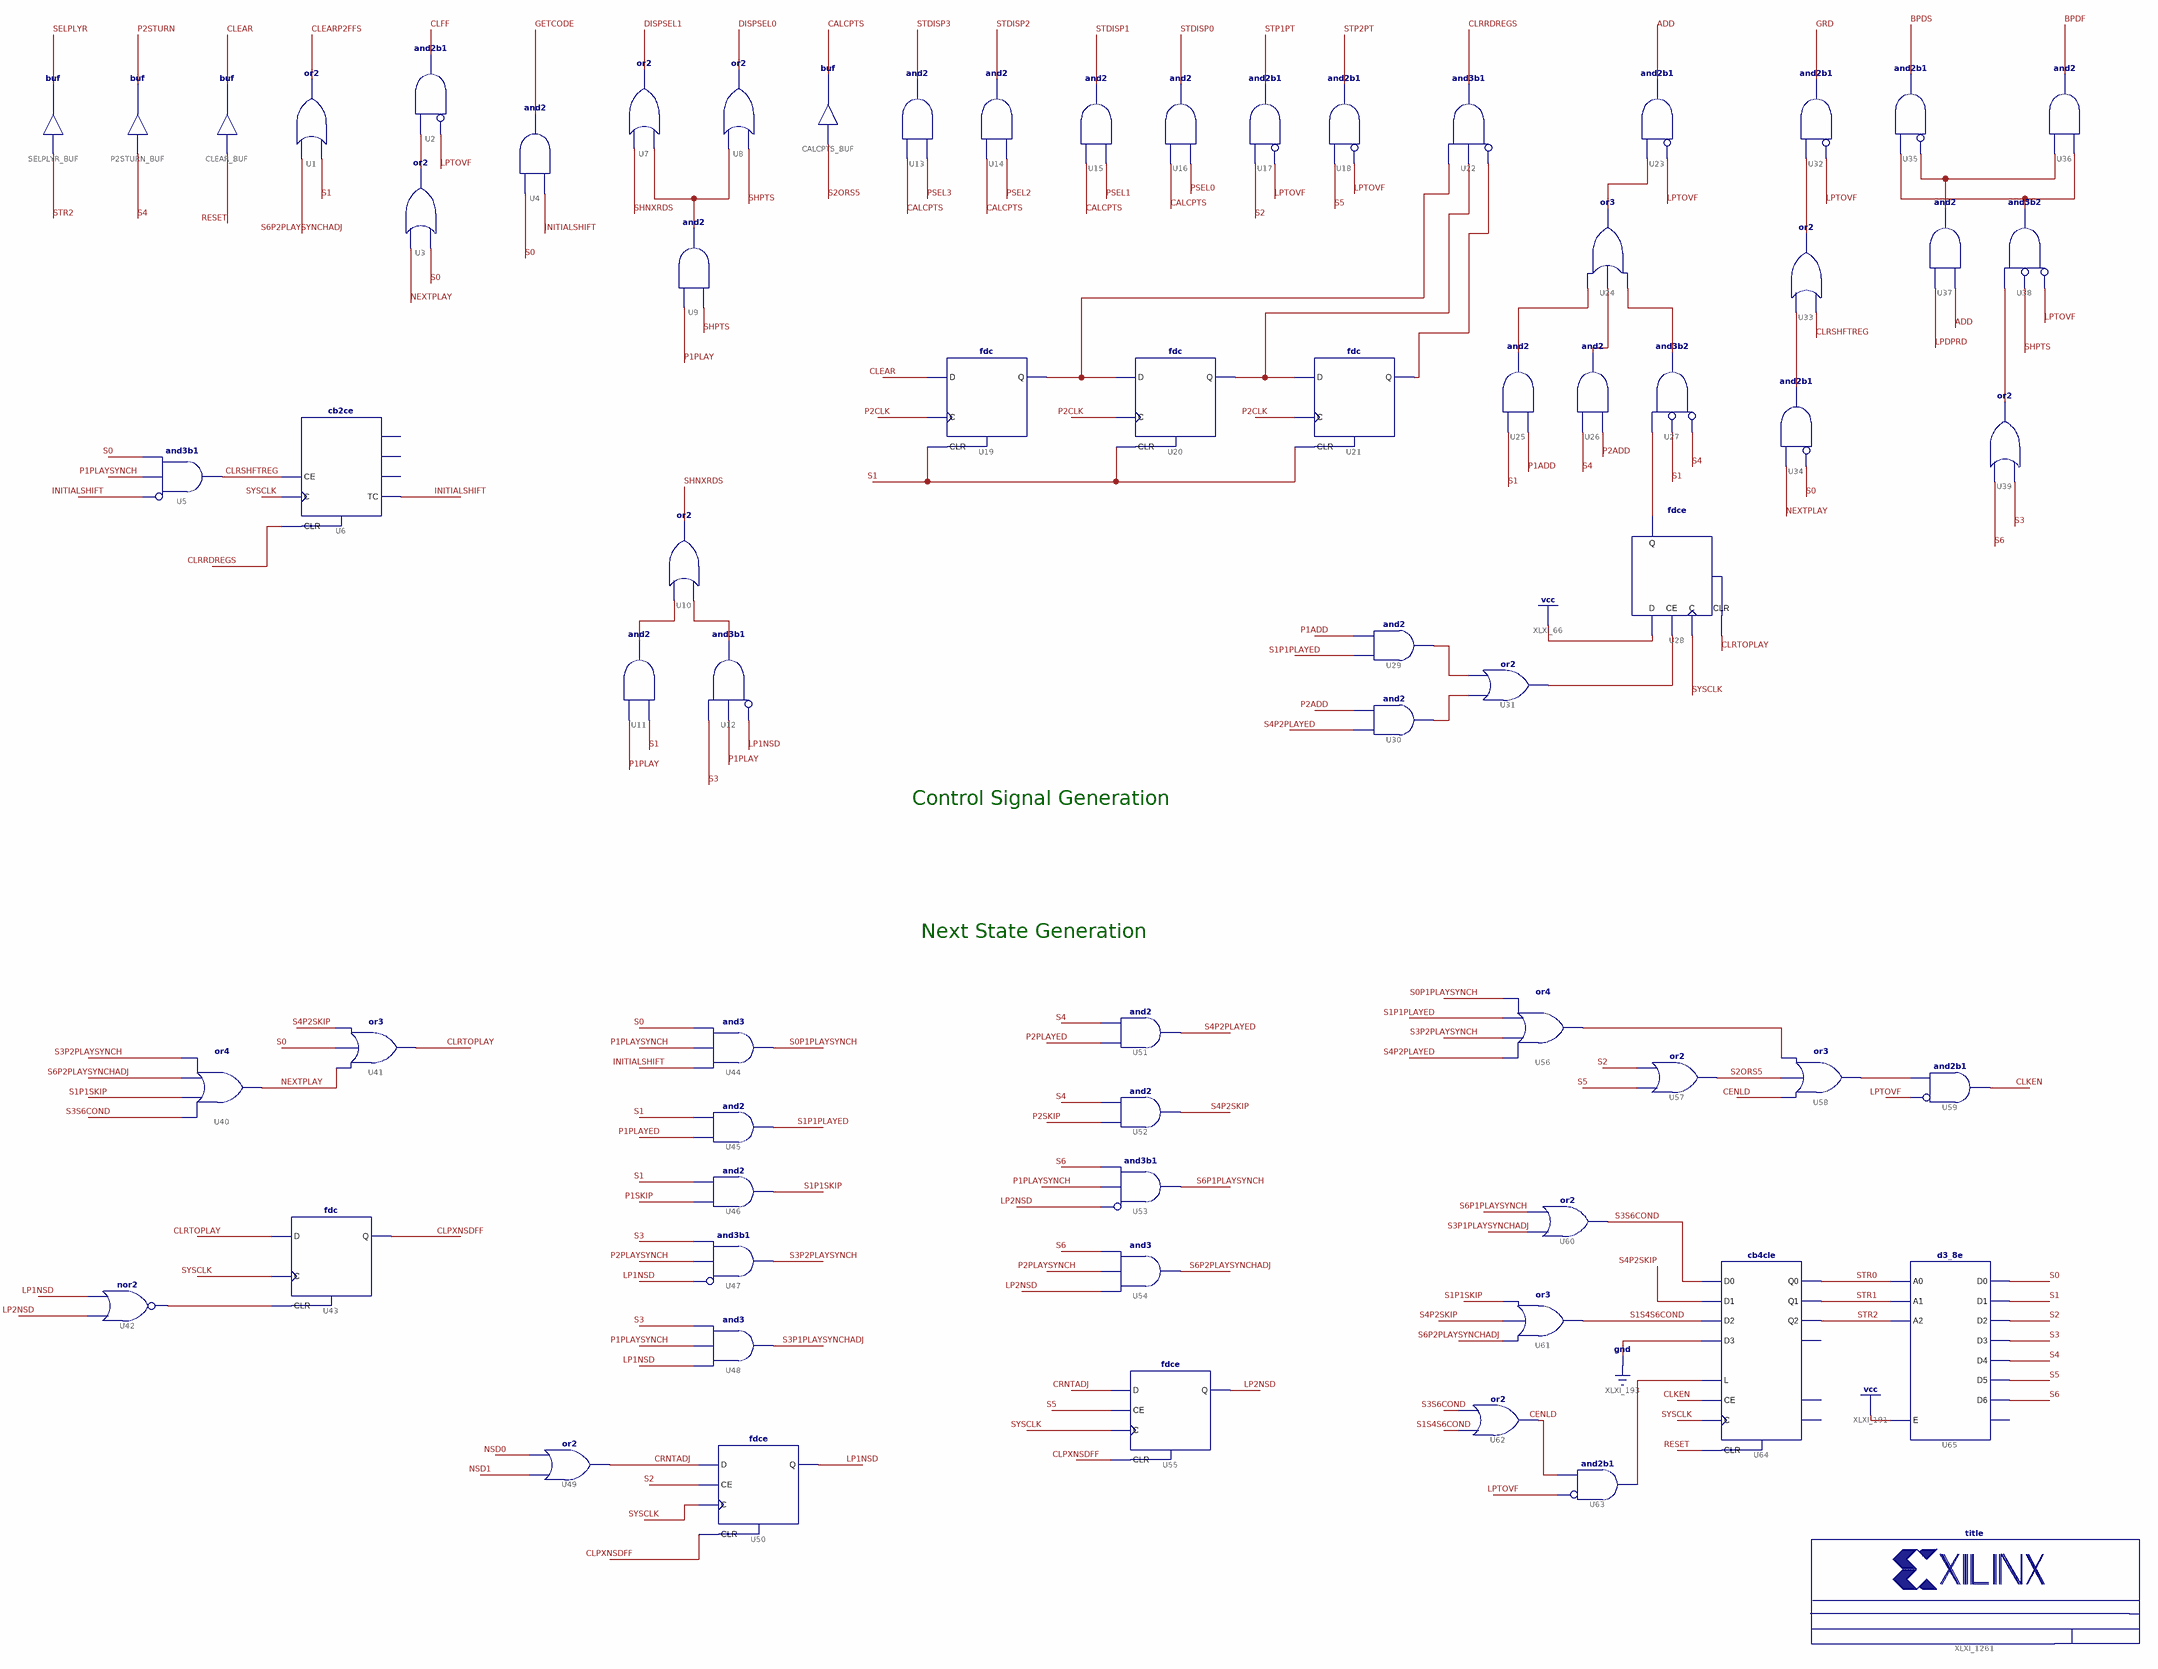
[diagram p0: schematic sheet 1]
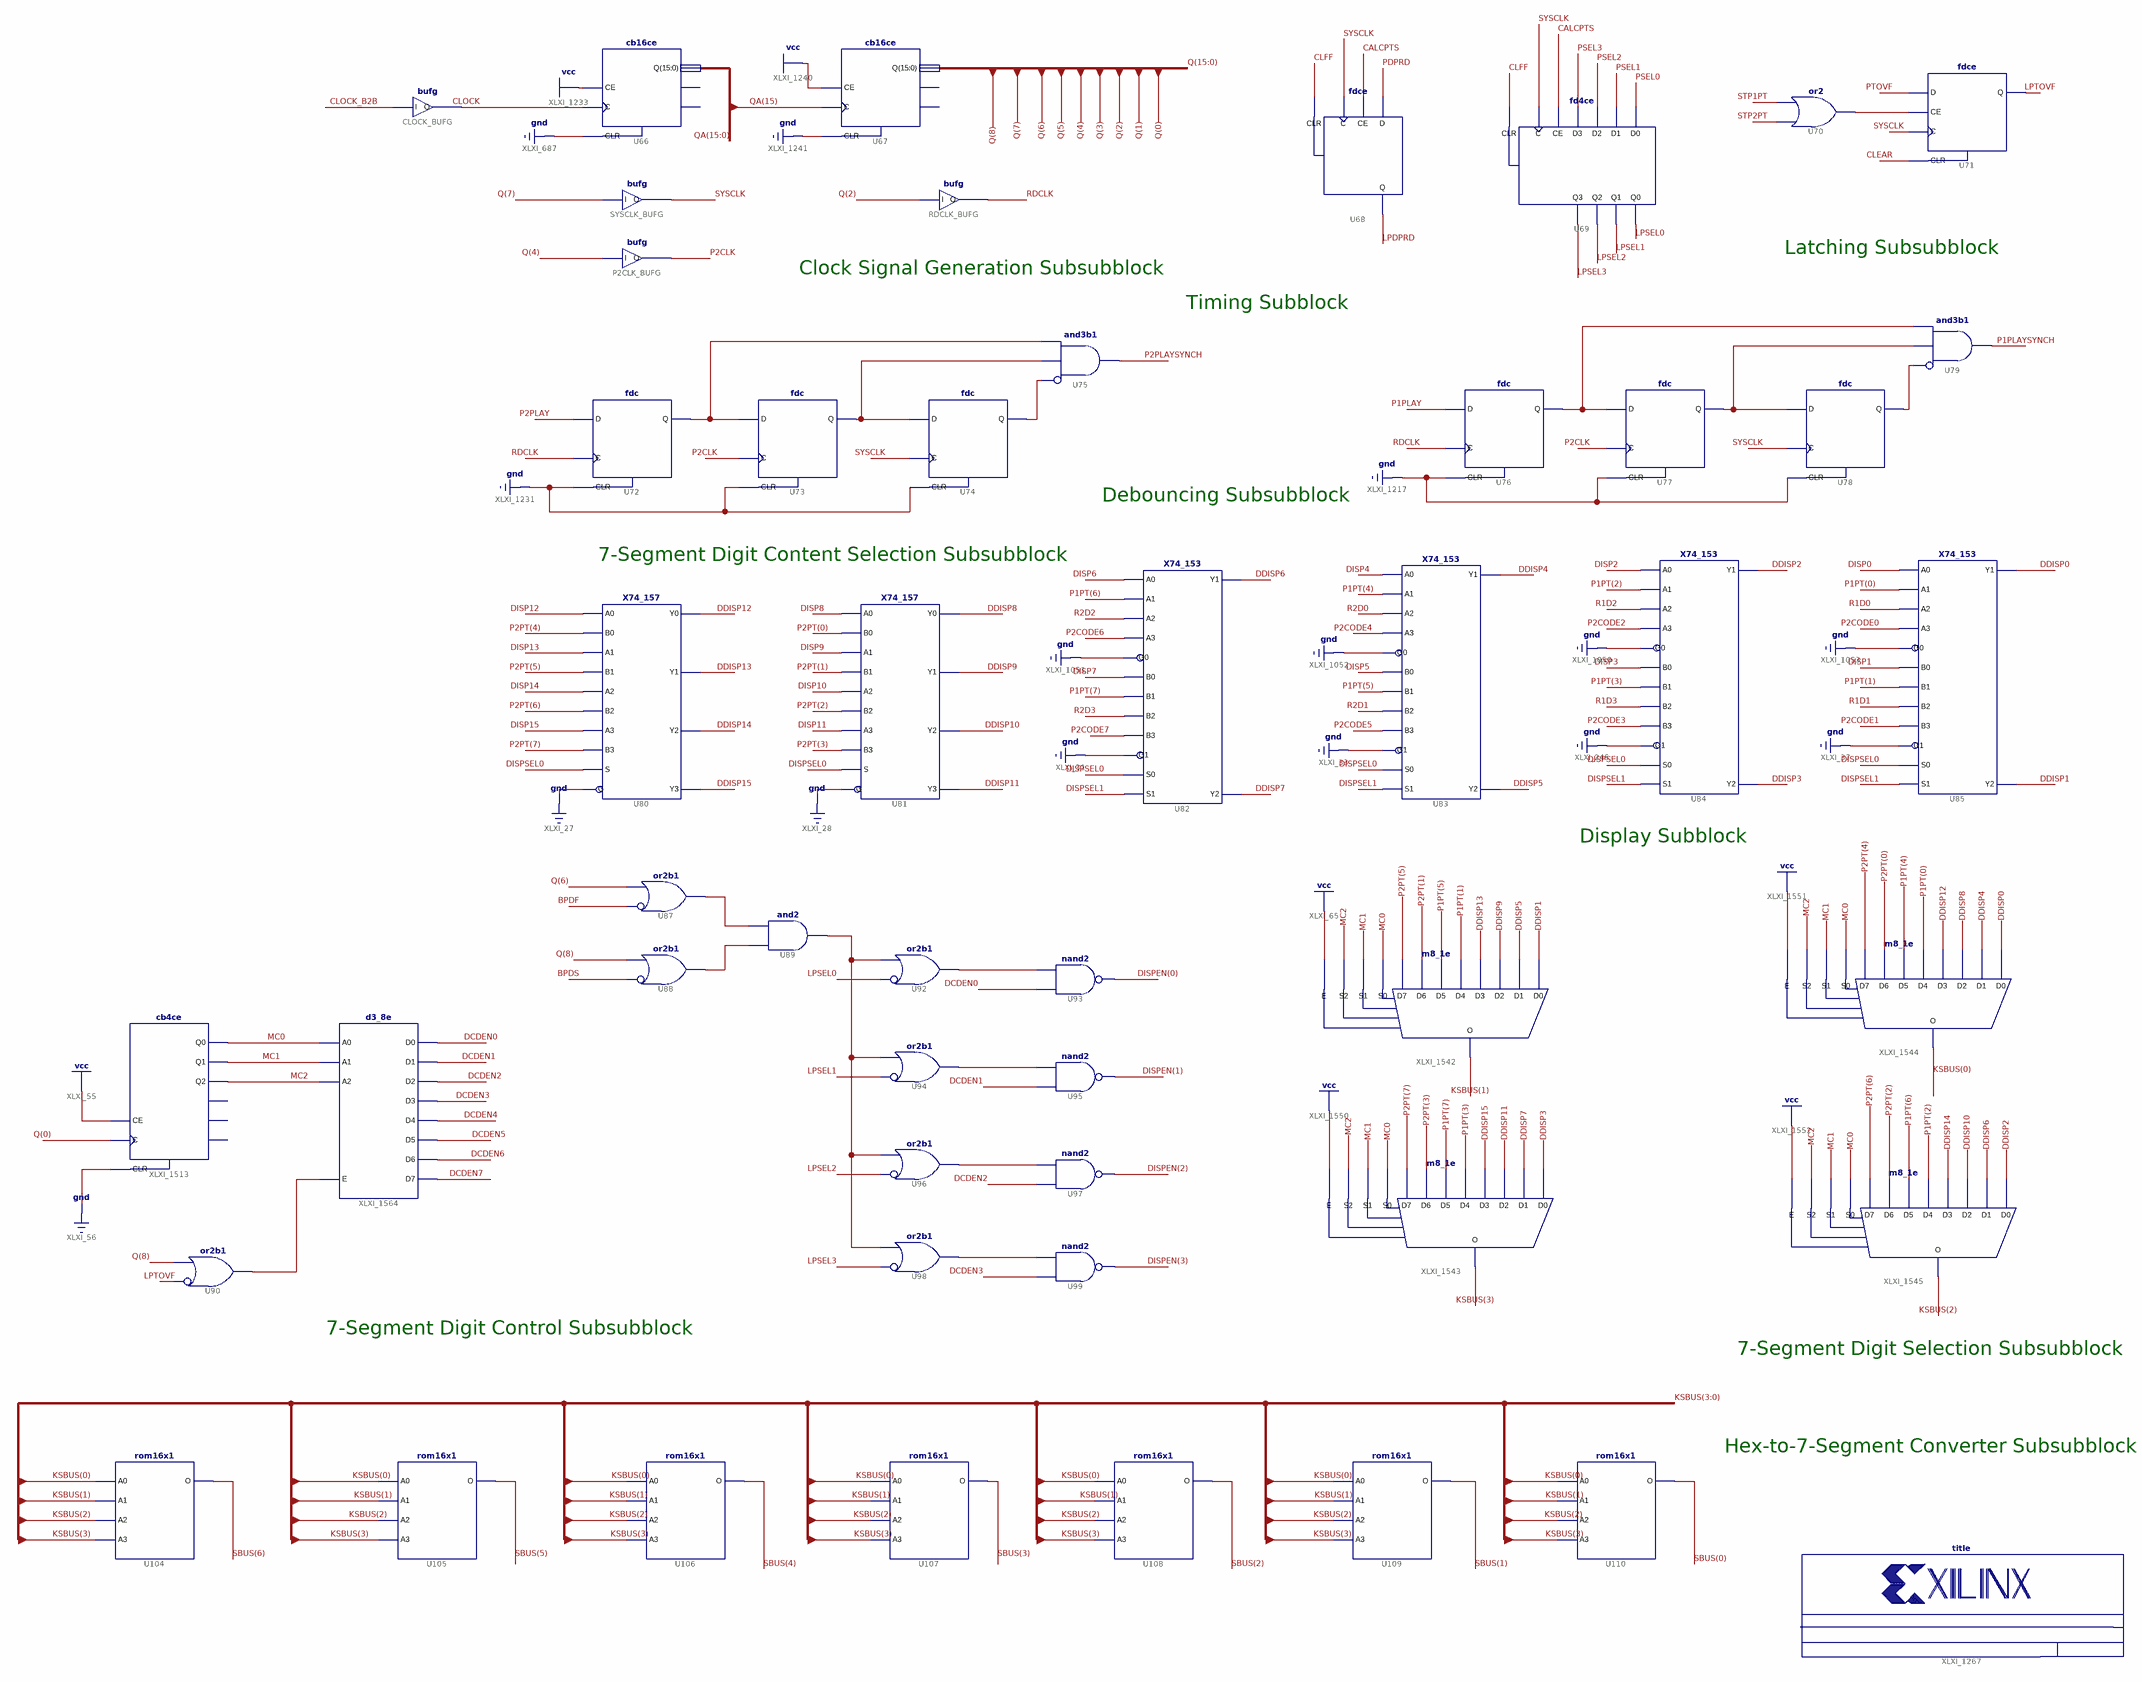
[diagram p1: schematic sheet 2]
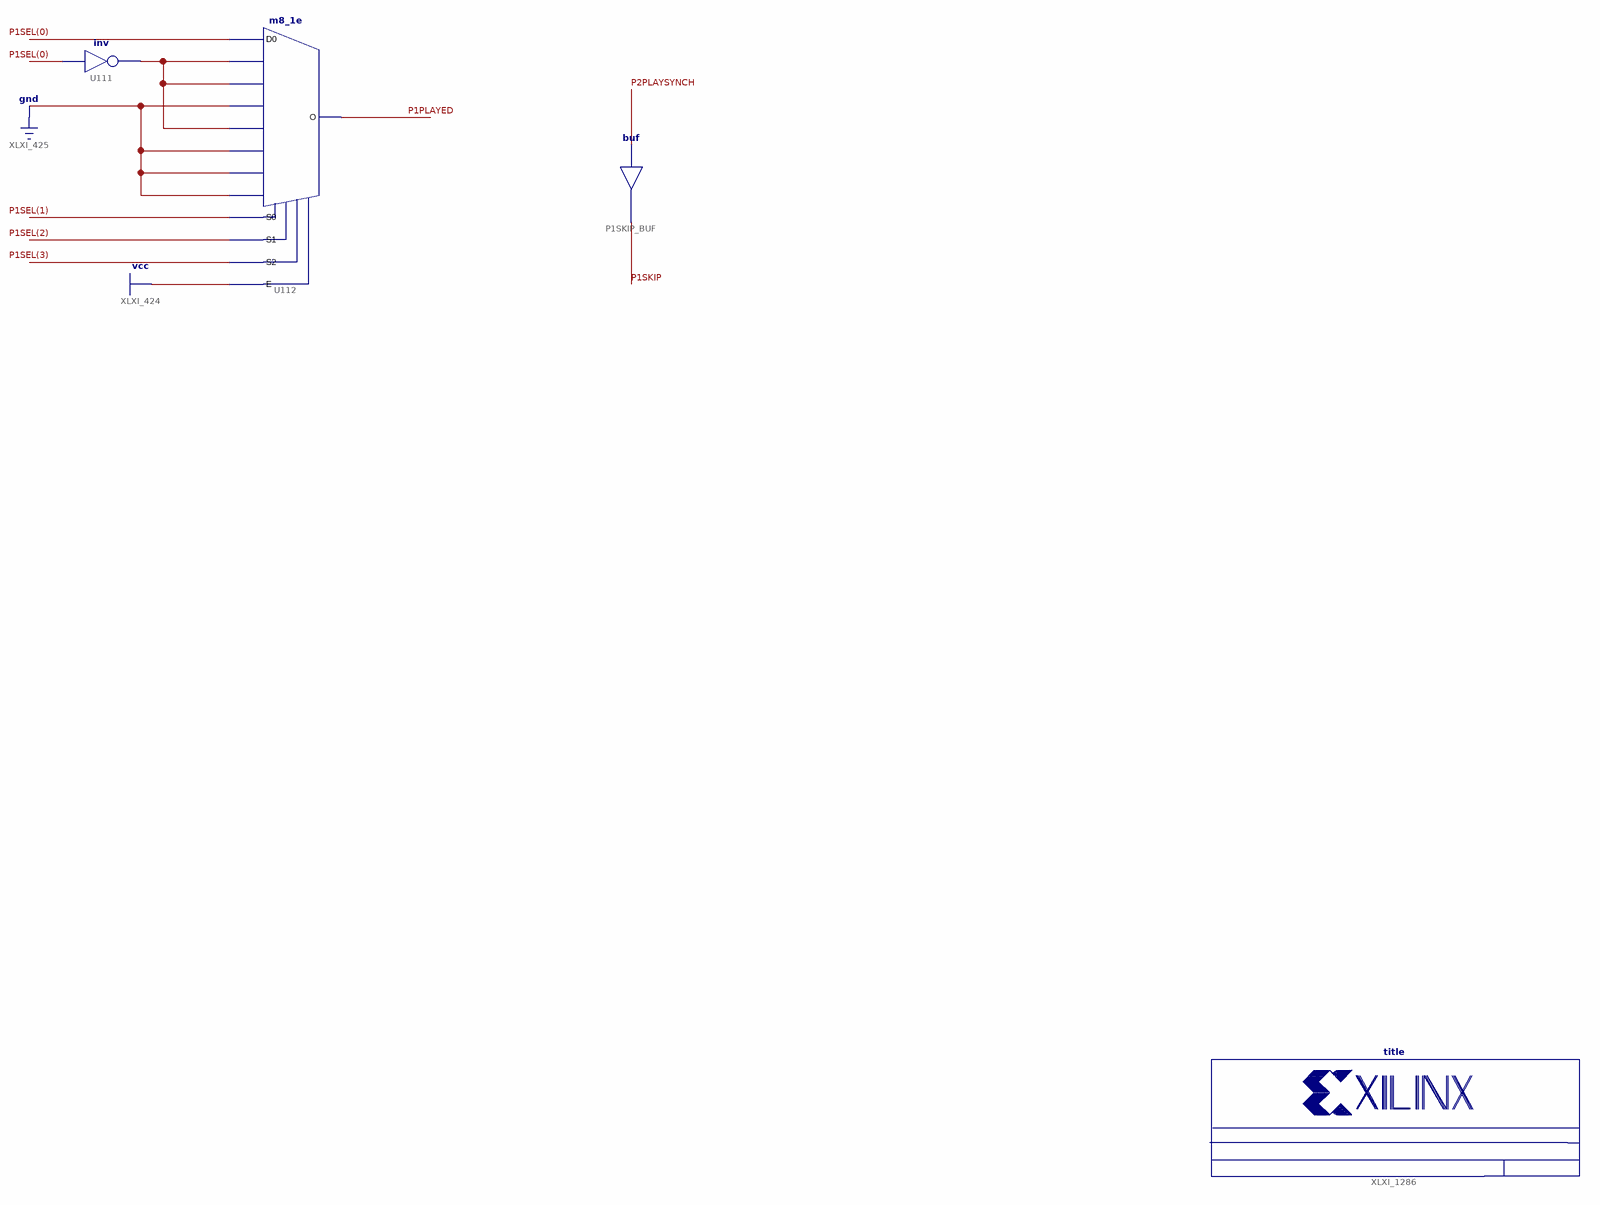
[diagram p2: schematic sheet 3]
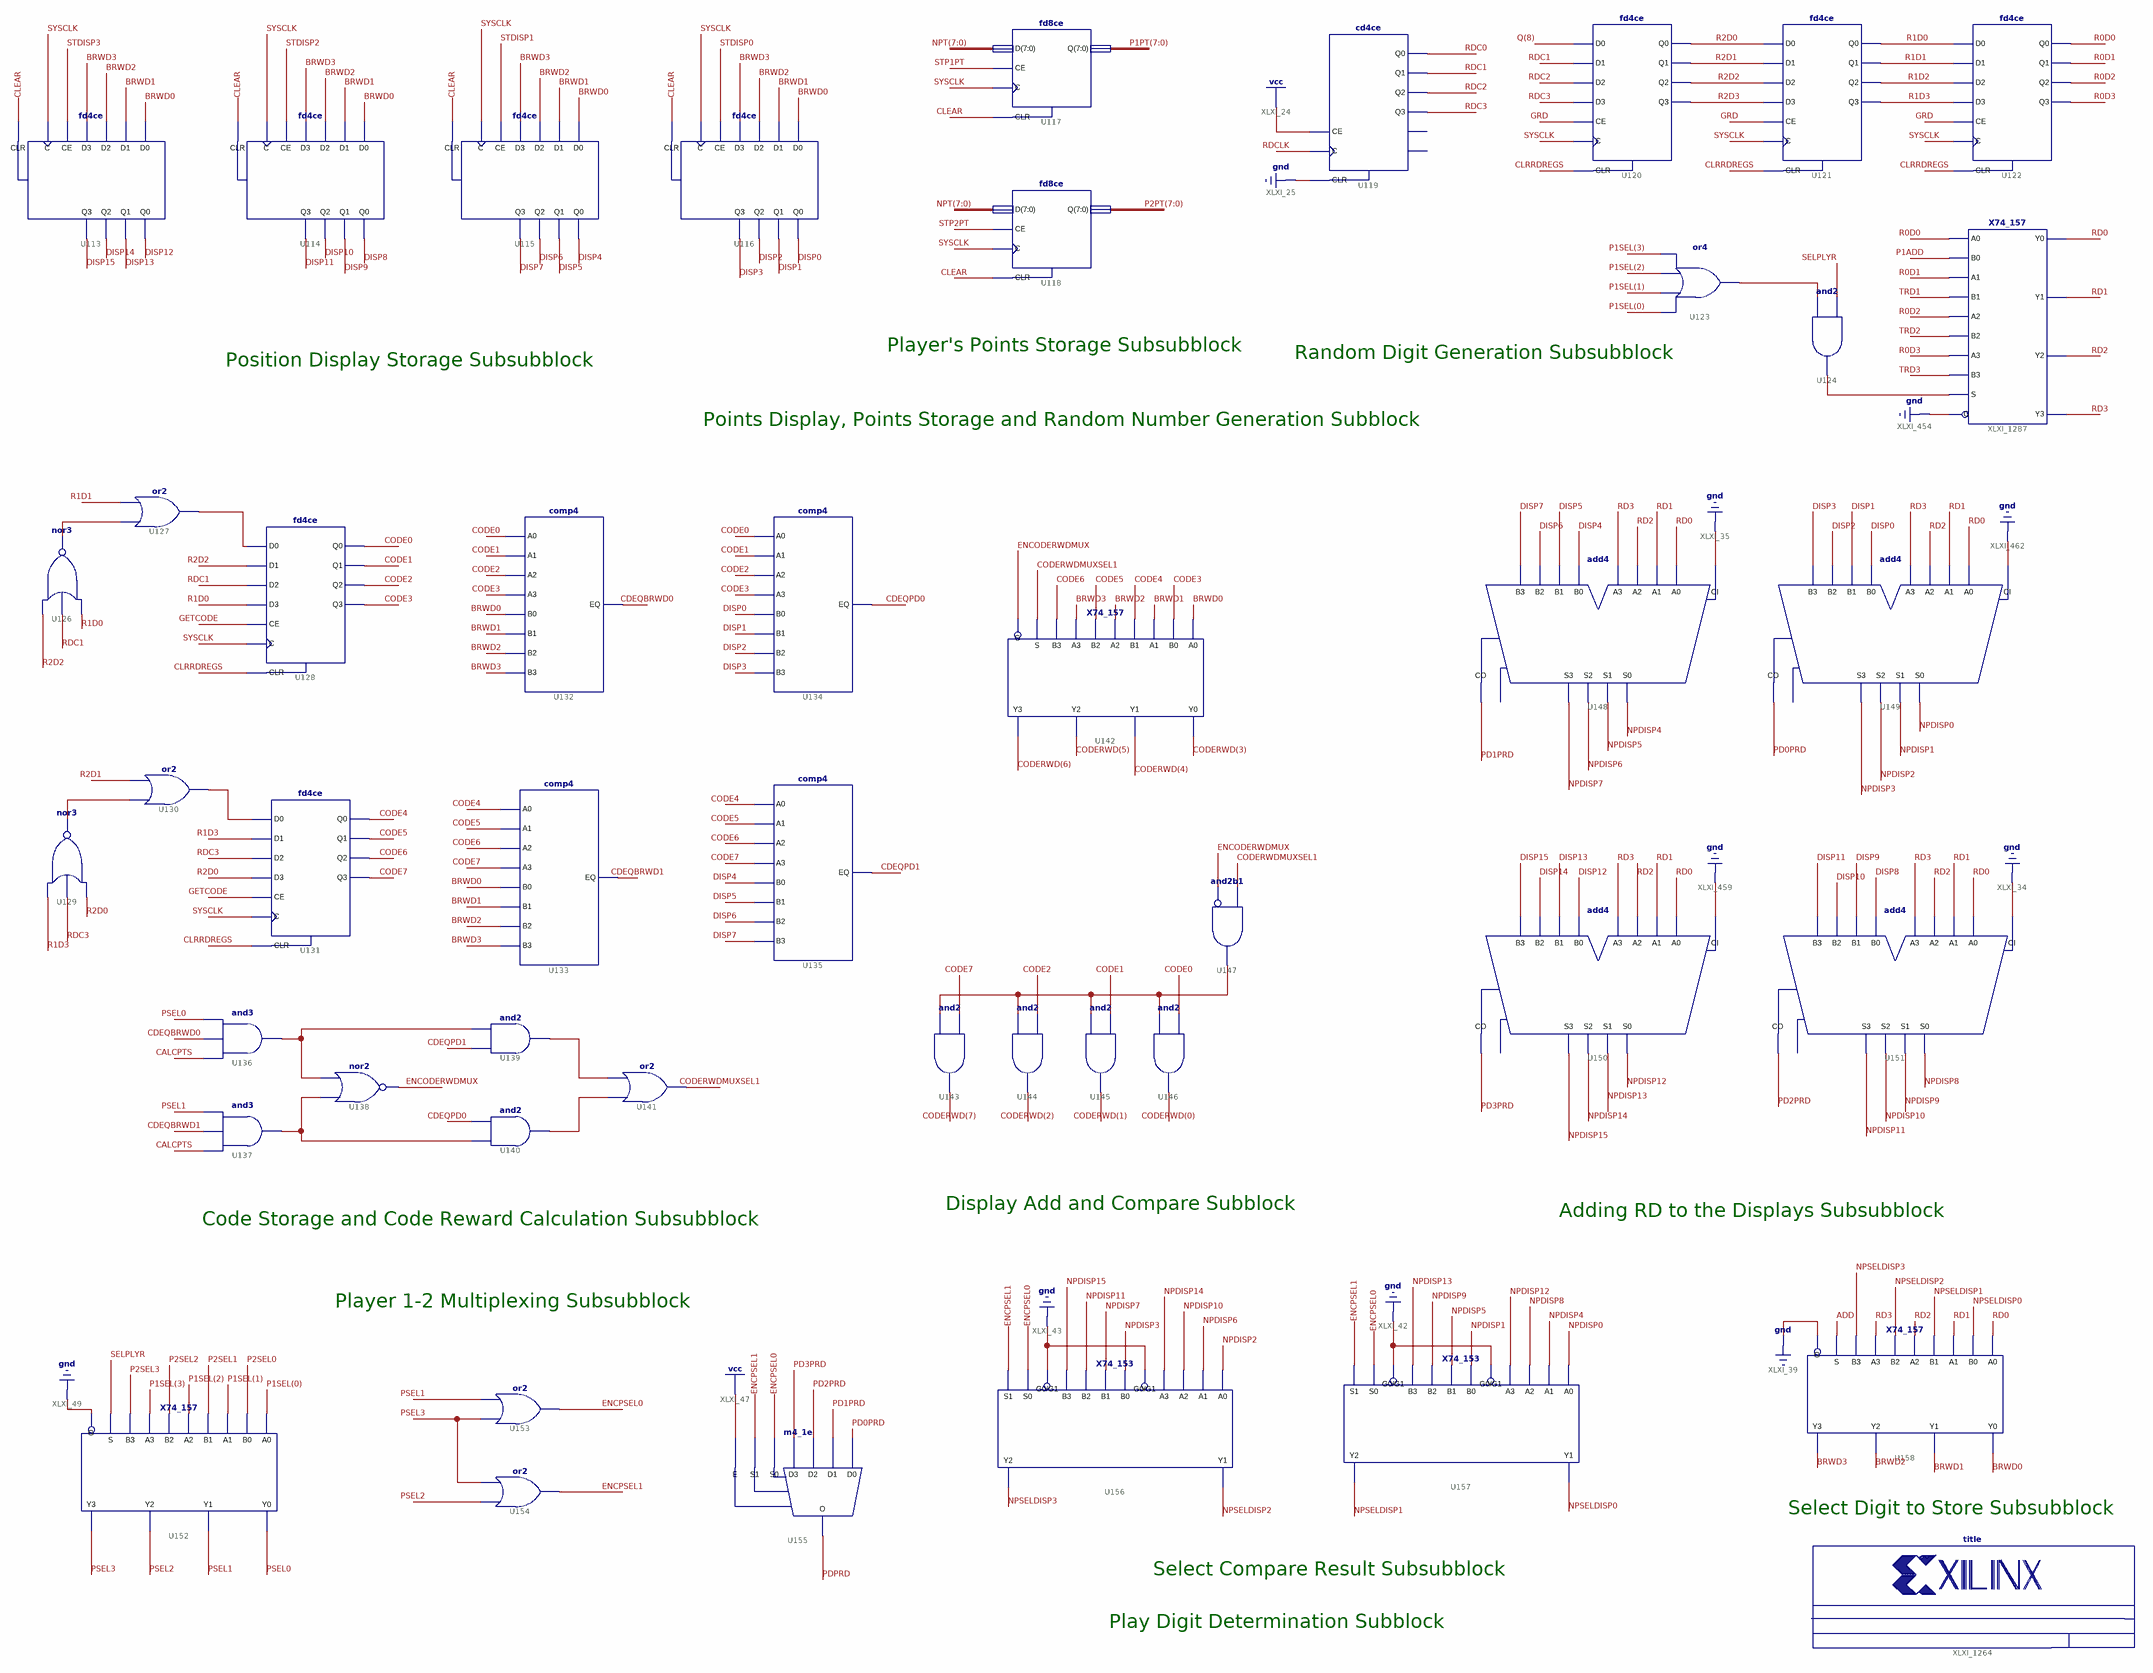
[diagram p3: schematic sheet 4]
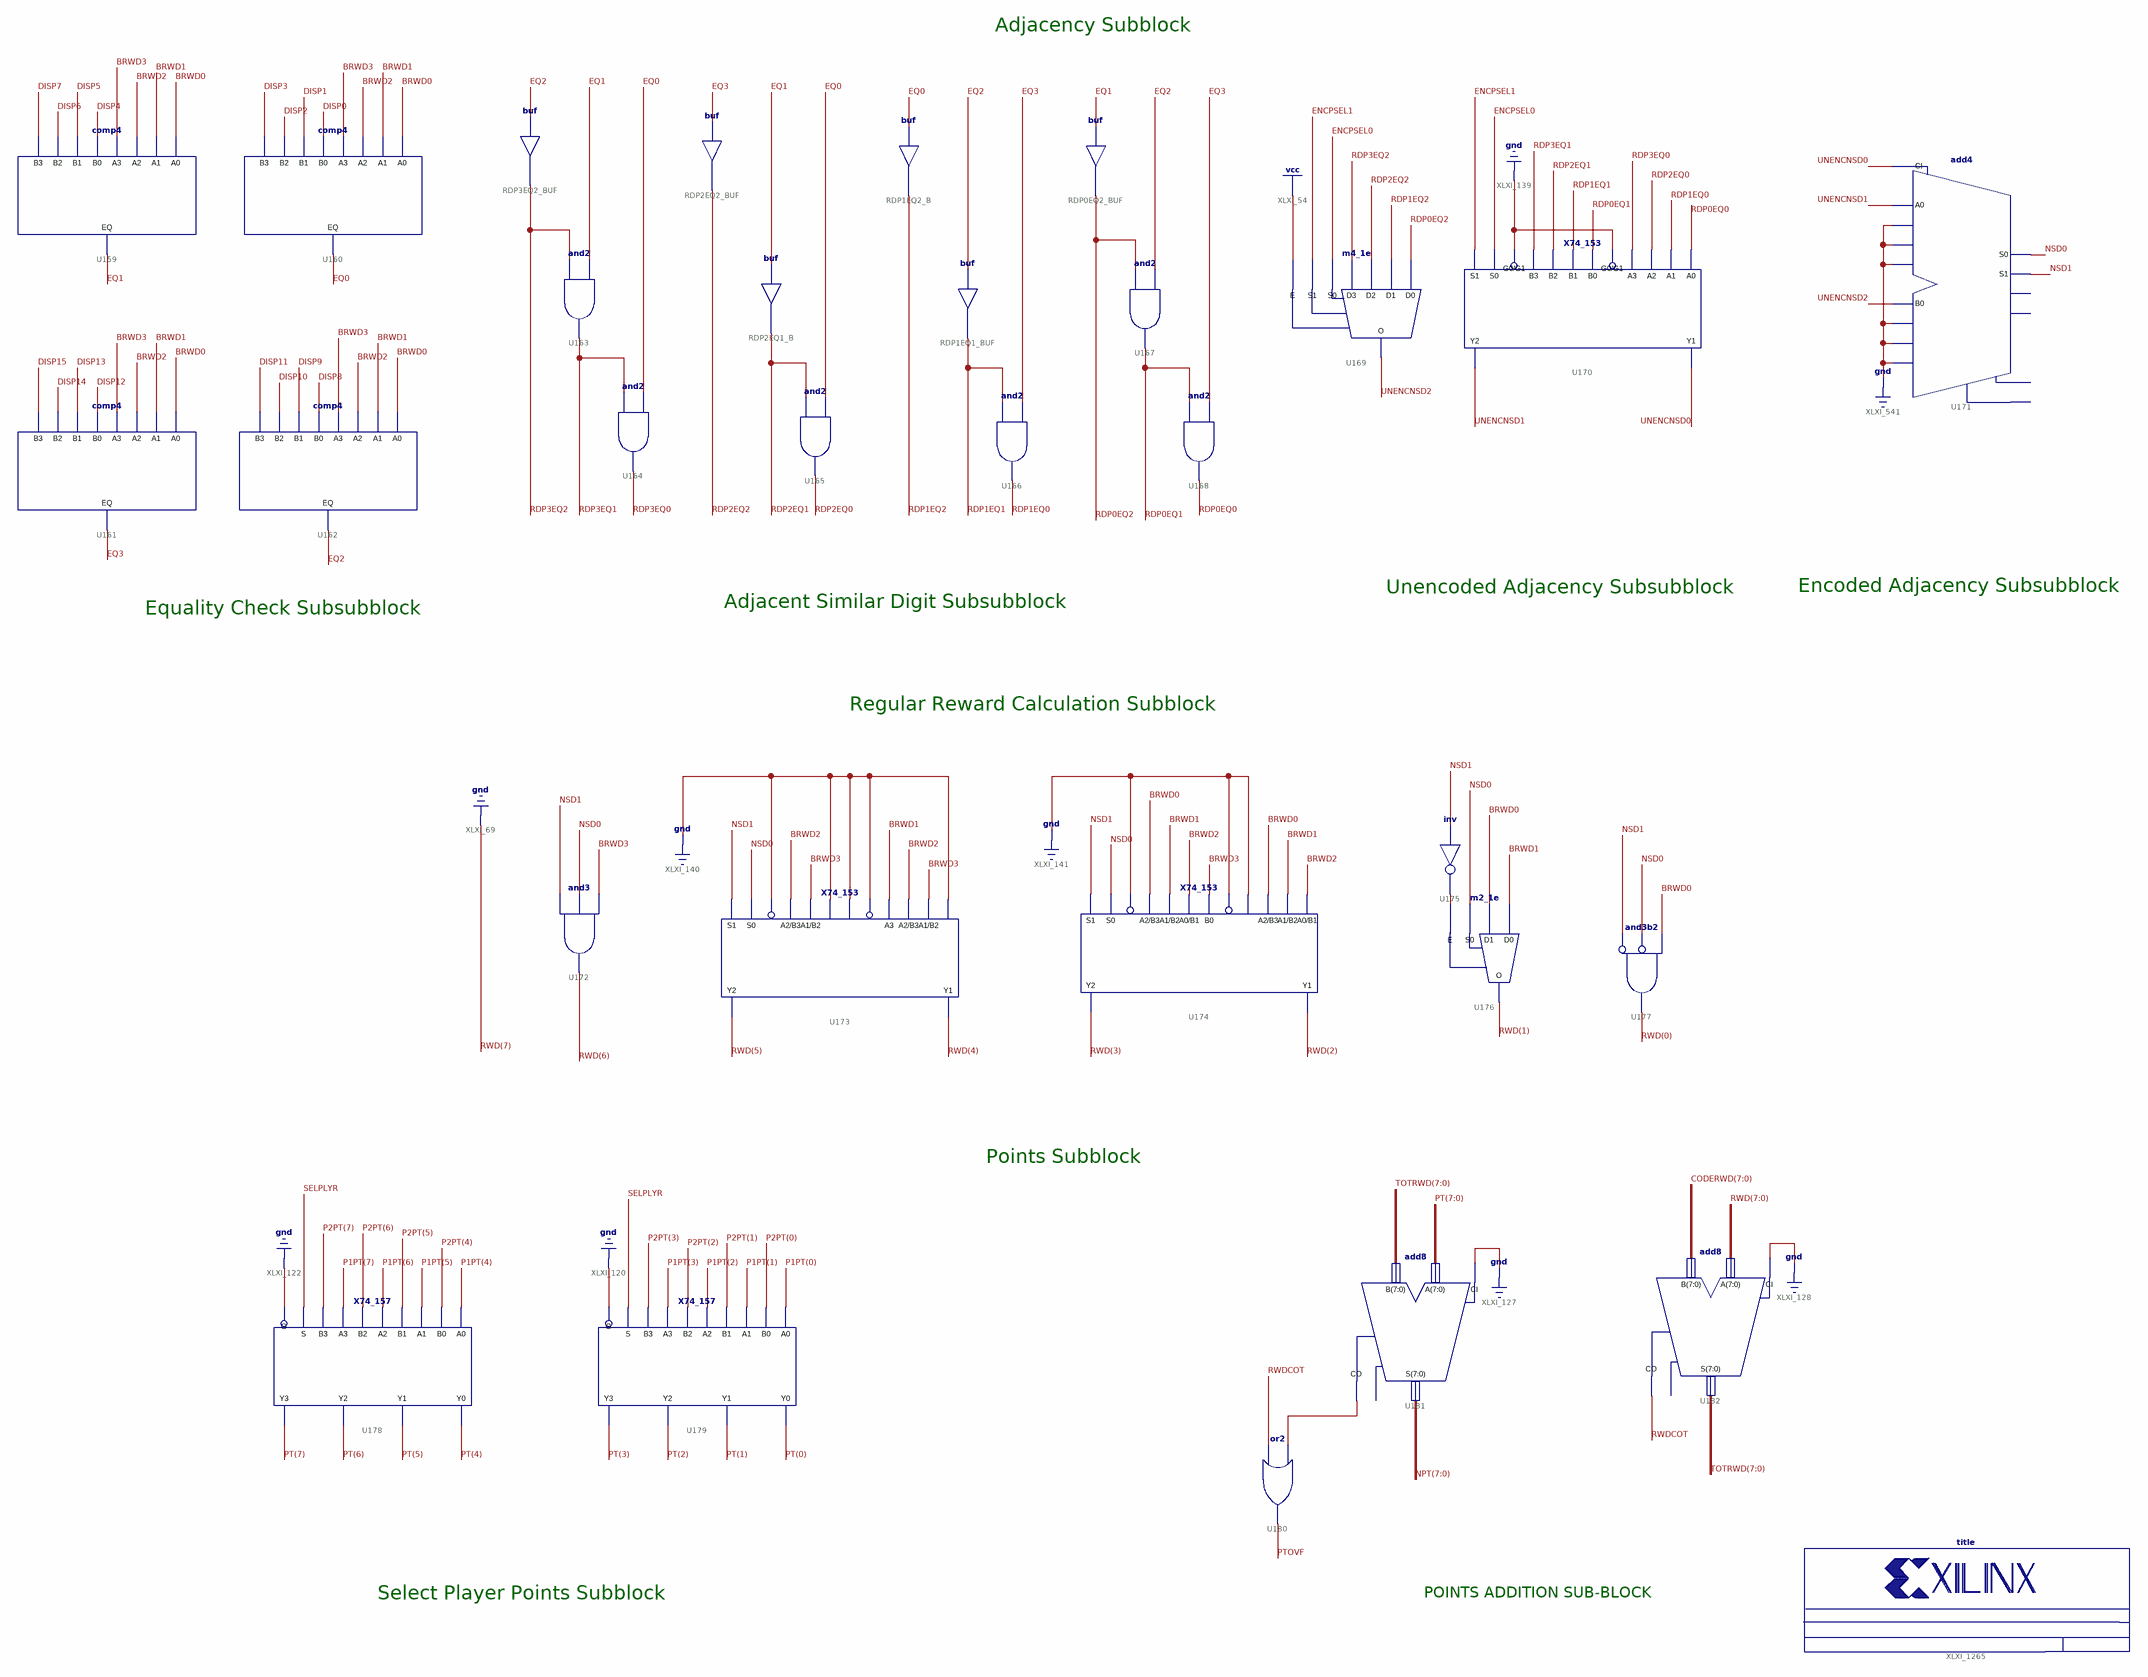
[diagram p4: schematic sheet 5]
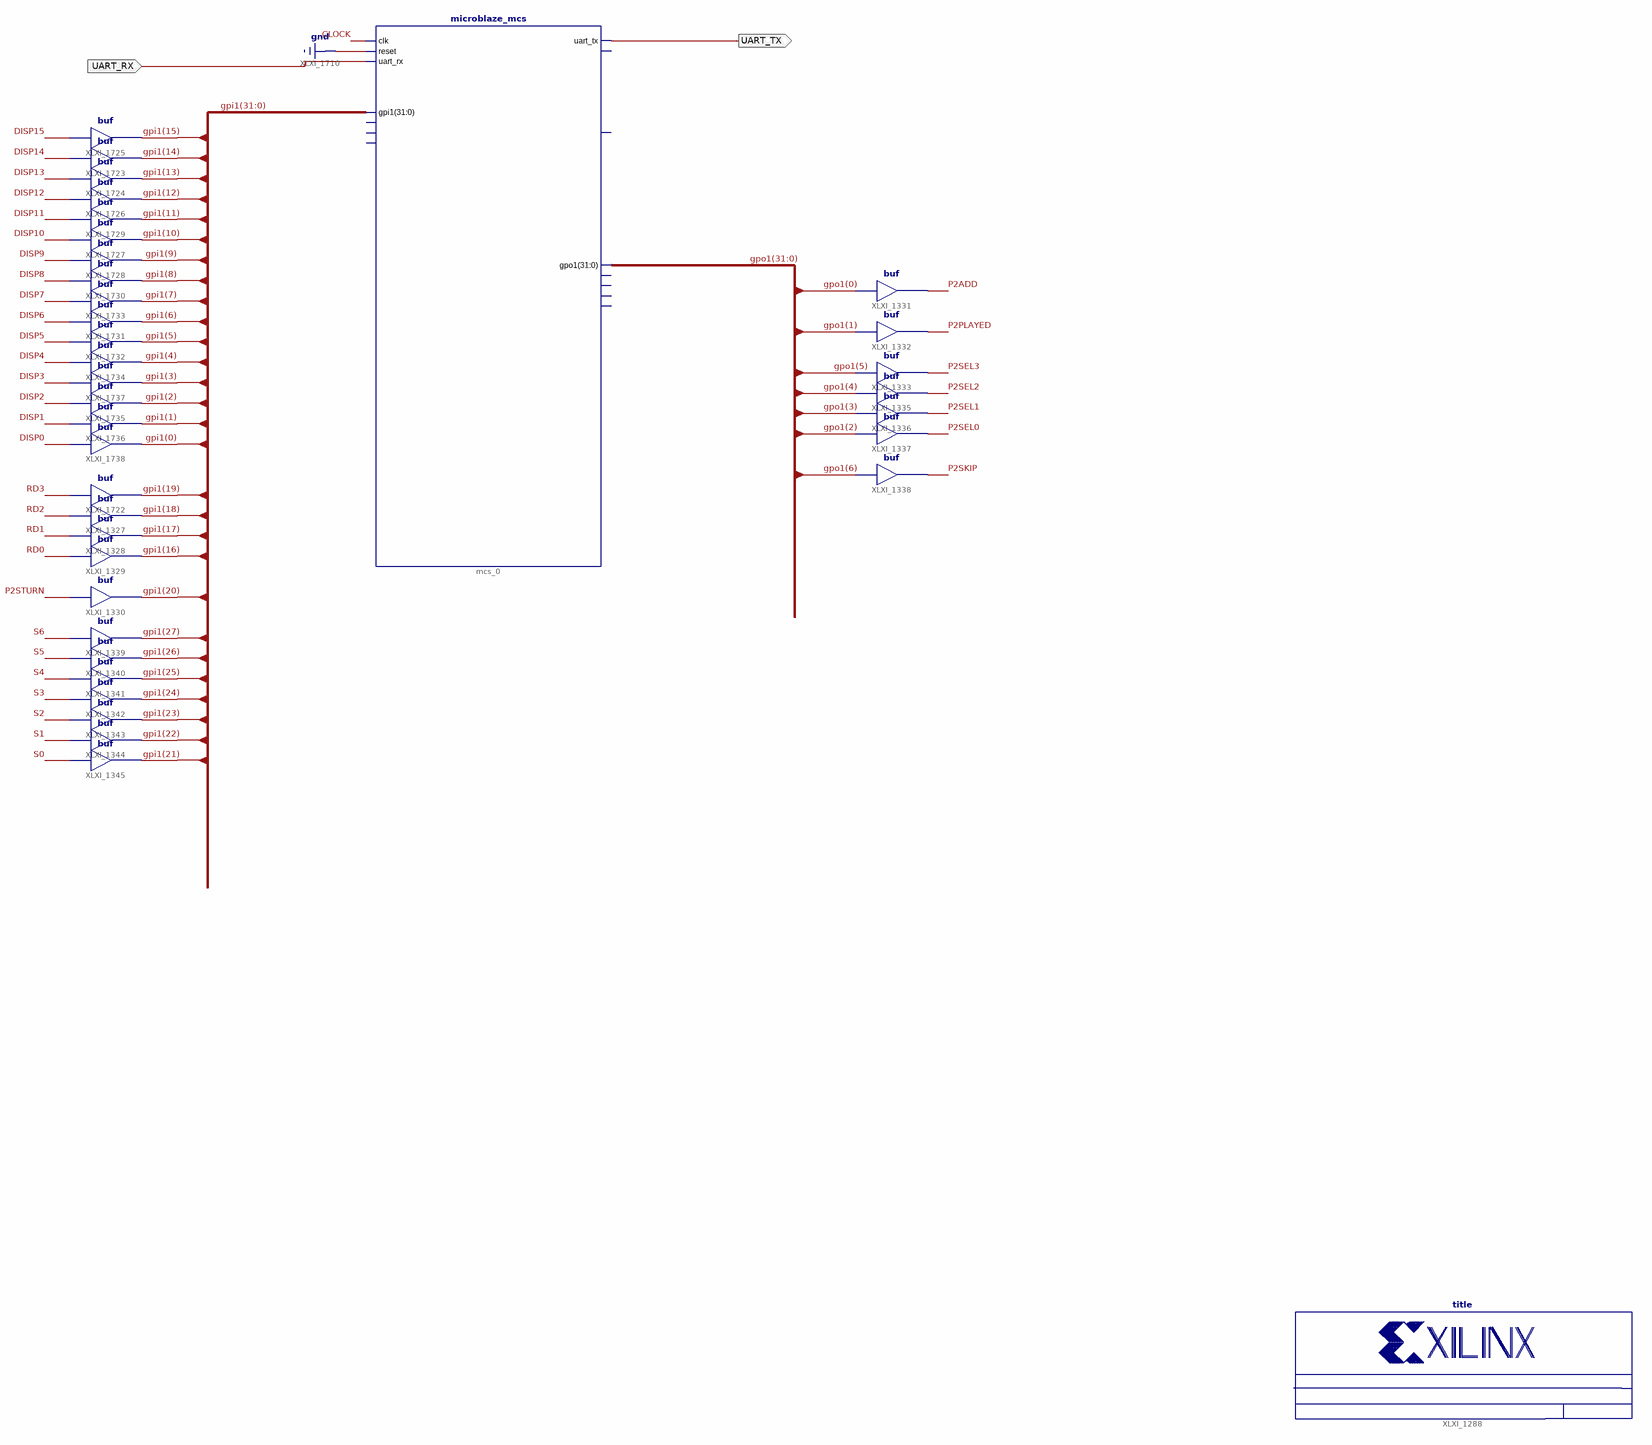
[diagram p5: schematic sheet 6]
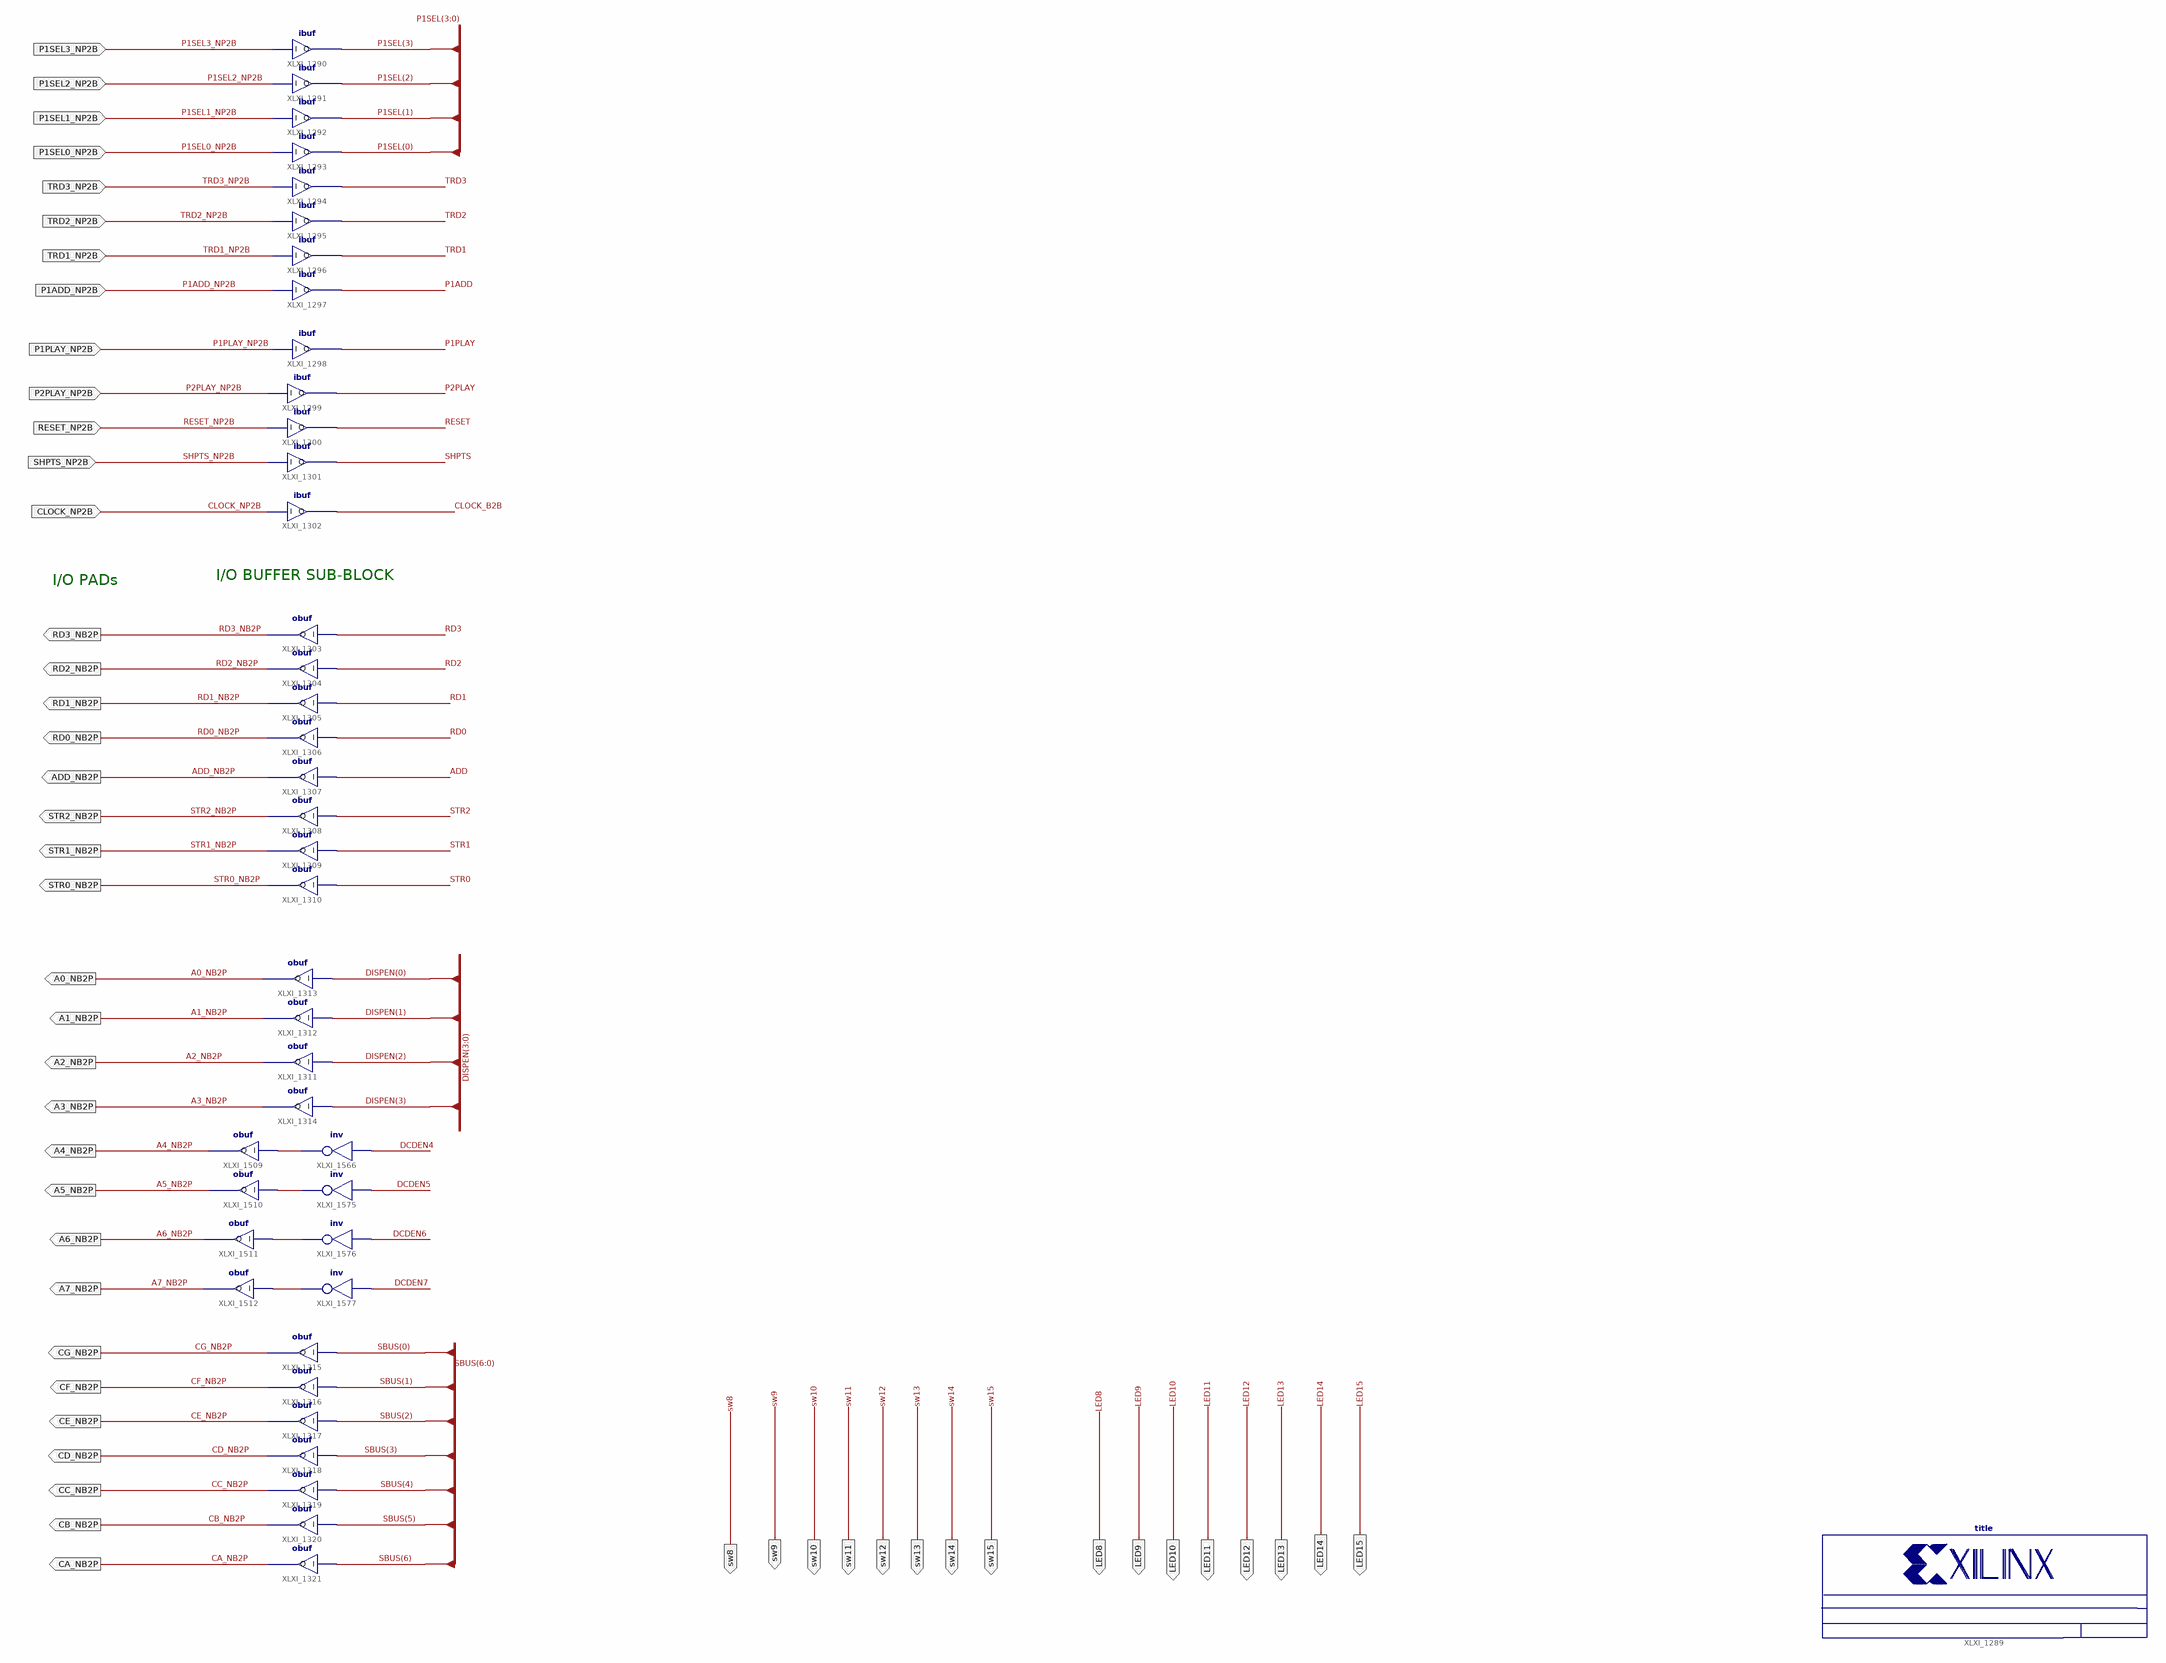
[diagram p6: schematic sheet 7]
// Xilinx ISE schematic ppm.sch (artix7) as structural Verilog: 280 symbols, 54 ports
module ppm (
  input  P1ADD_NP2B,
  input  TRD1_NP2B,
  input  TRD2_NP2B,
  input  TRD3_NP2B,
  input  P1SEL0_NP2B,
  input  P1SEL1_NP2B,
  input  P1SEL2_NP2B,
  input  P1SEL3_NP2B,
  input  P1PLAY_NP2B,
  input  RESET_NP2B,
  input  SHPTS_NP2B,
  input  CLOCK_NP2B,
  input  P2PLAY_NP2B,
  input  UART_RX,
  output RD3_NB2P,
  output RD2_NB2P,
  output RD1_NB2P,
  output RD0_NB2P,
  output ADD_NB2P,
  output STR2_NB2P,
  output STR1_NB2P,
  output STR0_NB2P,
  output A4_NB2P,
  output A3_NB2P,
  output A1_NB2P,
  output CG_NB2P,
  output CF_NB2P,
  output CE_NB2P,
  output CD_NB2P,
  output CC_NB2P,
  output CB_NB2P,
  output CA_NB2P,
  output A2_NB2P,
  output A7_NB2P,
  output A6_NB2P,
  output A5_NB2P,
  output A0_NB2P,
  output sw8,
  output sw9,
  output sw10,
  output sw11,
  output sw12,
  output sw13,
  output sw14,
  output sw15,
  output LED10,
  output LED11,
  output LED12,
  output LED13,
  output LED14,
  output LED15,
  output LED8,
  output LED9,
  output UART_TX
);

  wire ADD, BPDF, BPDS, BRWD0, BRWD1, BRWD2, BRWD3, CALCPTS, CDEQBRWD0, CDEQBRWD1, CDEQPD0, CDEQPD1, CENLD,
       CLEAR, CLEARP2FFS, CLFF, CLKEN, CLOCK, CLOCK_B2B, CLPXNSDFF, CLRRDREGS, CLRSHFTREG, CLRTOPLAY, CODE0,
       CODE1, CODE2, CODE3, CODE4, CODE5, CODE6, CODE7, CODERWDMUXSEL1, CRNTADJ, DCDEN0, DCDEN1, DCDEN2,
       DCDEN3, DCDEN4, DCDEN5, DCDEN6, DCDEN7, DDISP0, DDISP1, DDISP2, DDISP3, DDISP4, DDISP5, DDISP6,
       DDISP7, DDISP8, DDISP9, DDISP10, DDISP11, DDISP12, DDISP13, DDISP14, DDISP15, DISP0, DISP1, DISP2,
       DISP3, DISP4, DISP5, DISP6, DISP7, DISP8, DISP9, DISP10, DISP11, DISP12, DISP13, DISP14, DISP15,
       DISPSEL0, DISPSEL1, ENCODERWDMUX, ENCPSEL0, ENCPSEL1, EQ0, EQ1, EQ2, EQ3, GETCODE, GRD, INITIALSHIFT,
       INT_NET0, INT_NET1, INT_NET2, INT_NET6, INT_NET8, INT_NET10, INT_NET11, LP1NSD, LP2NSD, LPDPRD,
       LPSEL0, LPSEL1, LPSEL2, LPSEL3, LPTOVF, MC0, MC1, MC2, NEXTPLAY, NPDISP0, NPDISP1, NPDISP2, NPDISP3,
       NPDISP4, NPDISP5, NPDISP6, NPDISP7, NPDISP8, NPDISP9, NPDISP10, NPDISP11, NPDISP12, NPDISP13,
       NPDISP14, NPDISP15, NPSELDISP0, NPSELDISP1, NPSELDISP2, NPSELDISP3, NSD0, NSD1, P1ADD, P1PLAY,
       P1PLAYED, P1PLAYSYNCH, P1SKIP, P2ADD, P2CLK, P2CODE0, P2CODE1, P2CODE2, P2CODE3, P2CODE4, P2CODE5,
       P2CODE6, P2CODE7, P2PLAY, P2PLAYED, P2PLAYSYNCH, P2SEL0, P2SEL1, P2SEL2, P2SEL3, P2SKIP, P2STURN,
       PD0PRD, PD1PRD, PD2PRD, PD3PRD, PDPRD, PSEL0, PSEL1, PSEL2, PSEL3, PTOVF, R0D0, R0D1, R0D2, R0D3,
       R1D0, R1D1, R1D2, R1D3, R2D0, R2D1, R2D2, R2D3, RD0, RD1, RD2, RD3, RDC0, RDC1, RDC2, RDC3, RDCLK,
       RDP0EQ0, RDP0EQ1, RDP0EQ2, RDP1EQ0, RDP1EQ1, RDP1EQ2, RDP2EQ0, RDP2EQ1, RDP2EQ2, RDP3EQ0, RDP3EQ1,
       RDP3EQ2, RESET, RWDCOT, S0, S0P1PLAYSYNCH, S1, S1P1PLAYED, S1P1SKIP, S1S4S6COND, S2, S2ORS5, S3,
       S3P1PLAYSYNCHADJ, S3P2PLAYSYNCH, S3S6COND, S4, S4P2PLAYED, S4P2SKIP, S5, S6, S6P1PLAYSYNCH,
       S6P2PLAYSYNCHADJ, SELPLYR, SHNXRDS, SHPTS, STDISP0, STDISP1, STDISP2, STDISP3, STP1PT, STP2PT, STR0,
       STR1, STR2, SYSCLK, TRD1, TRD2, TRD3, UNENCNSD0, UNENCNSD1, UNENCNSD2, XLXN_12, XLXN_19, XLXN_74,
       XLXN_140, XLXN_141, XLXN_149, XLXN_151, XLXN_156, XLXN_163, XLXN_164, XLXN_181, XLXN_188, XLXN_193,
       XLXN_194, XLXN_195, XLXN_202, XLXN_203, XLXN_210, XLXN_460, XLXN_462, XLXN_474, XLXN_1195, XLXN_1346,
       XLXN_1347, XLXN_1764, XLXN_1802, XLXN_9551, XLXN_9714, XLXN_10471, XLXN_10478, XLXN_10482, XLXN_10484,
       XLXN_10495, XLXN_10958, XLXN_10960, XLXN_10962, XLXN_11102, XLXN_11265, XLXN_11266, XLXN_11270,
       XLXN_11271, XLXN_11292, XLXN_11294, XLXN_11295, XLXN_11310, XLXN_11347, XLXN_12041, XLXN_12042,
       XLXN_12043, XLXN_12049;
  wire [3:0] DISPEN, KSBUS, P1SEL;
  wire [6:0] RWD, SBUS;
  wire [7:0] CODERWD, NPT, P1PT, P2PT, PT, TOTRWD;
  wire [15:0] Q, QA;
  wire [31:0] gpi1, gpo1;

  m8_1e U112 (
    .D0(P1SEL[0]), .D1(XLXN_1195), .D2(XLXN_1195), .D3(1'b0), .D4(XLXN_1195), .D5(1'b0), .D6(1'b0),
    .D7(1'b0), .E(1'b1), .S0(P1SEL[1]), .S1(P1SEL[2]), .S2(P1SEL[3]), .O(P1PLAYED));
  not U111 (XLXN_1195, P1SEL[0]);
  buf P1SKIP_BUF (P1SKIP, P2PLAYSYNCH);
  X74_153 U85 (
    .A0(DISP0), .A1(P1PT[0]), .A2(R1D0), .A3(P2CODE0), .B0(DISP1), .B1(P1PT[1]), .B2(R1D1), .B3(P2CODE1),
    .G0(1'b0), .G1(1'b0), .S0(DISPSEL0), .S1(DISPSEL1), .Y1(DDISP0), .Y2(DDISP1));
  X74_153 U84 (
    .A0(DISP2), .A1(P1PT[2]), .A2(R1D2), .A3(P2CODE2), .B0(DISP3), .B1(P1PT[3]), .B2(R1D3), .B3(P2CODE3),
    .G0(1'b0), .G1(1'b0), .S0(DISPSEL0), .S1(DISPSEL1), .Y1(DDISP2), .Y2(DDISP3));
  X74_153 U83 (
    .A0(DISP4), .A1(P1PT[4]), .A2(R2D0), .A3(P2CODE4), .B0(DISP5), .B1(P1PT[5]), .B2(R2D1), .B3(P2CODE5),
    .G0(1'b0), .G1(1'b0), .S0(DISPSEL0), .S1(DISPSEL1), .Y1(DDISP4), .Y2(DDISP5));
  rom16x1 #(.INIT("2812")) U104 (.A0(KSBUS[0]), .A1(KSBUS[1]), .A2(KSBUS[2]), .A3(KSBUS[3]), .O(SBUS[6]));
  rom16x1 #(.INIT("D860")) U105 (.A0(KSBUS[0]), .A1(KSBUS[1]), .A2(KSBUS[2]), .A3(KSBUS[3]), .O(SBUS[5]));
  rom16x1 #(.INIT("D004")) U106 (.A0(KSBUS[0]), .A1(KSBUS[1]), .A2(KSBUS[2]), .A3(KSBUS[3]), .O(SBUS[4]));
  rom16x1 #(.INIT("8692")) U107 (.A0(KSBUS[0]), .A1(KSBUS[1]), .A2(KSBUS[2]), .A3(KSBUS[3]), .O(SBUS[3]));
  rom16x1 #(.INIT("02BA")) U108 (.A0(KSBUS[0]), .A1(KSBUS[1]), .A2(KSBUS[2]), .A3(KSBUS[3]), .O(SBUS[2]));
  rom16x1 #(.INIT("208E")) U109 (.A0(KSBUS[0]), .A1(KSBUS[1]), .A2(KSBUS[2]), .A3(KSBUS[3]), .O(SBUS[1]));
  rom16x1 #(.INIT("1083")) U110 (.A0(KSBUS[0]), .A1(KSBUS[1]), .A2(KSBUS[2]), .A3(KSBUS[3]), .O(SBUS[0]));
  and U5 (CLRSHFTREG, ~INITIALSHIFT, P1PLAYSYNCH, S0);  // and3b1
  and U29 (XLXN_164, S1P1PLAYED, P1ADD);
  and U30 (XLXN_163, S4P2PLAYED, P2ADD);
  or U31 (INT_NET10, XLXN_163, XLXN_164);
  fdce U28 (.C(SYSCLK), .CE(INT_NET10), .CLR(CLRTOPLAY), .D(1'b1), .Q(XLXN_156));
  and U48 (S3P1PLAYSYNCHADJ, LP1NSD, P1PLAYSYNCH, S3);
  and U47 (S3P2PLAYSYNCH, ~LP1NSD, P2PLAYSYNCH, S3);  // and3b1
  and U46 (S1P1SKIP, P1SKIP, S1);
  and U45 (S1P1PLAYED, P1PLAYED, S1);
  and U44 (S0P1PLAYSYNCH, INITIALSHIFT, P1PLAYSYNCH, S0);
  nor U42 (INT_NET11, LP2NSD, LP1NSD);
  fdc U43 (.C(SYSCLK), .CLR(INT_NET11), .D(CLRTOPLAY), .Q(CLPXNSDFF));
  and U63 (XLXN_474, ~LPTOVF, CENLD);  // and2b1
  or U60 (S3S6COND, S3P1PLAYSYNCHADJ, S6P1PLAYSYNCH);
  cb4cle U64 (
    .C(SYSCLK), .CE(CLKEN), .CLR(RESET), .D0(S3S6COND), .D1(S4P2SKIP), .D2(S1S4S6COND), .D3(1'b0),
    .L(XLXN_474), .Q0(STR0), .Q1(STR1), .Q2(STR2));  // open: CEO, Q3, TC
  d3_8e U65 (
    .A0(STR0), .A1(STR1), .A2(STR2), .E(1'b1), .D0(S0), .D1(S1), .D2(S2), .D3(S3), .D4(S4), .D5(S5), .D6(S6));  // open: D7
  or U40 (NEXTPLAY, S3S6COND, S1P1SKIP, S6P2PLAYSYNCHADJ, S3P2PLAYSYNCH);
  or U41 (CLRTOPLAY, NEXTPLAY, S0, S4P2SKIP);
  buf SELPLYR_BUF (SELPLYR, STR2);
  buf P2STURN_BUF (P2STURN, S4);
  or U1 (CLEARP2FFS, S1, S6P2PLAYSYNCHADJ);
  and U2 (CLFF, ~LPTOVF, XLXN_12);  // and2b1
  or U3 (XLXN_12, S0, NEXTPLAY);
  or U7 (DISPSEL1, XLXN_19, SHNXRDS);
  or U8 (DISPSEL0, SHPTS, XLXN_19);
  and U9 (XLXN_19, SHPTS, P1PLAY);
  or U10 (SHNXRDS, XLXN_141, XLXN_140);
  and U11 (XLXN_140, S1, P1PLAY);
  and U12 (XLXN_141, ~LP1NSD, P1PLAY, S3);  // and3b1
  buf CALCPTS_BUF (CALCPTS, S2ORS5);
  and U13 (STDISP3, PSEL3, CALCPTS);
  and U14 (STDISP2, PSEL2, CALCPTS);
  and U36 (BPDF, INT_NET1, INT_NET2);
  and U38 (INT_NET1, ~LPTOVF, ~SHPTS, XLXN_188);  // and3b2
  and U37 (INT_NET2, ADD, LPDPRD);
  and U35 (BPDS, ~INT_NET2, INT_NET1);  // and2b1
  or U33 (INT_NET6, CLRSHFTREG, INT_NET8);
  and U34 (INT_NET8, ~S0, NEXTPLAY);  // and2b1
  and U32 (GRD, ~LPTOVF, INT_NET6);  // and2b1
  and U27 (XLXN_151, ~S4, ~S1, XLXN_156);  // and3b2
  or U24 (XLXN_9551, XLXN_151, XLXN_149, XLXN_9714);
  and U15 (STDISP1, PSEL1, CALCPTS);
  and U25 (XLXN_9714, P1ADD, S1);
  and U26 (XLXN_149, P2ADD, S4);
  or U39 (XLXN_188, S3, S6);
  or U62 (CENLD, S1S4S6COND, S3S6COND);
  fdce U50 (.C(SYSCLK), .CE(S2), .CLR(CLPXNSDFF), .D(CRNTADJ), .Q(LP1NSD));
  or U49 (CRNTADJ, NSD1, NSD0);
  fdce U55 (.C(SYSCLK), .CE(S5), .CLR(CLPXNSDFF), .D(CRNTADJ), .Q(LP2NSD));
  and U54 (S6P2PLAYSYNCHADJ, LP2NSD, P2PLAYSYNCH, S6);
  and U53 (S6P1PLAYSYNCH, ~LP2NSD, P1PLAYSYNCH, S6);  // and3b1
  and U52 (S4P2SKIP, P2SKIP, S4);
  and U51 (S4P2PLAYED, P2PLAYED, S4);
  or U56 (XLXN_460, S4P2PLAYED, S3P2PLAYSYNCH, S1P1PLAYED, S0P1PLAYSYNCH);
  and U59 (CLKEN, ~LPTOVF, XLXN_462);  // and2b1
  or U57 (S2ORS5, S5, S2);
  or U58 (XLXN_462, CENLD, S2ORS5, XLXN_460);
  or U61 (S1S4S6COND, S6P2PLAYSYNCHADJ, S4P2SKIP, S1P1SKIP);
  fd4ce U122 (
    .C(SYSCLK), .CE(GRD), .CLR(CLRRDREGS), .D0(R1D0), .D1(R1D1), .D2(R1D2), .D3(R1D3), .Q0(R0D0), .Q1(R0D1),
    .Q2(R0D2), .Q3(R0D3));
  fd4ce U121 (
    .C(SYSCLK), .CE(GRD), .CLR(CLRRDREGS), .D0(R2D0), .D1(R2D1), .D2(R2D2), .D3(R2D3), .Q0(R1D0), .Q1(R1D1),
    .Q2(R1D2), .Q3(R1D3));
  fd4ce U120 (
    .C(SYSCLK), .CE(GRD), .CLR(CLRRDREGS), .D0(Q[8]), .D1(RDC1), .D2(RDC2), .D3(RDC3), .Q0(R2D0), .Q1(R2D1),
    .Q2(R2D2), .Q3(R2D3));
  or U123 (XLXN_1347, P1SEL[0], P1SEL[1], P1SEL[2], P1SEL[3]);
  and U124 (XLXN_1346, XLXN_1347, SELPLYR);
  cd4ce U119 (.C(RDCLK), .CE(1'b1), .CLR(1'b0), .Q0(RDC0), .Q1(RDC1), .Q2(RDC2), .Q3(RDC3));  // open: CEO, TC
  fd8ce U117 (.C(SYSCLK), .CE(STP1PT), .CLR(CLEAR), .D(NPT), .Q(P1PT));
  fd8ce U118 (.C(SYSCLK), .CE(STP2PT), .CLR(CLEAR), .D(NPT), .Q(P2PT));
  m4_1e U155 (.D0(PD0PRD), .D1(PD1PRD), .D2(PD2PRD), .D3(PD3PRD), .E(1'b1), .S0(ENCPSEL0), .S1(ENCPSEL1), .O(PDPRD));
  or U153 (ENCPSEL0, PSEL3, PSEL1);
  or U154 (ENCPSEL1, PSEL2, PSEL3);
  X74_153 U157 (
    .A0(NPDISP0), .A1(NPDISP4), .A2(NPDISP8), .A3(NPDISP12), .B0(NPDISP1), .B1(NPDISP5), .B2(NPDISP9),
    .B3(NPDISP13), .G0(1'b0), .G1(1'b0), .S0(ENCPSEL0), .S1(ENCPSEL1), .Y1(NPSELDISP0), .Y2(NPSELDISP1));
  X74_153 U156 (
    .A0(NPDISP2), .A1(NPDISP6), .A2(NPDISP10), .A3(NPDISP14), .B0(NPDISP3), .B1(NPDISP7), .B2(NPDISP11),
    .B3(NPDISP15), .G0(1'b0), .G1(1'b0), .S0(ENCPSEL0), .S1(ENCPSEL1), .Y1(NPSELDISP2), .Y2(NPSELDISP3));
  fd4ce U113 (
    .C(SYSCLK), .CE(STDISP3), .CLR(CLEAR), .D0(BRWD0), .D1(BRWD1), .D2(BRWD2), .D3(BRWD3), .Q0(DISP12),
    .Q1(DISP13), .Q2(DISP14), .Q3(DISP15));
  fd4ce U114 (
    .C(SYSCLK), .CE(STDISP2), .CLR(CLEAR), .D0(BRWD0), .D1(BRWD1), .D2(BRWD2), .D3(BRWD3), .Q0(DISP8),
    .Q1(DISP9), .Q2(DISP10), .Q3(DISP11));
  fd4ce U115 (
    .C(SYSCLK), .CE(STDISP1), .CLR(CLEAR), .D0(BRWD0), .D1(BRWD1), .D2(BRWD2), .D3(BRWD3), .Q0(DISP4),
    .Q1(DISP5), .Q2(DISP6), .Q3(DISP7));
  fd4ce U116 (
    .C(SYSCLK), .CE(STDISP0), .CLR(CLEAR), .D0(BRWD0), .D1(BRWD1), .D2(BRWD2), .D3(BRWD3), .Q0(DISP0),
    .Q1(DISP1), .Q2(DISP2), .Q3(DISP3));
  and U18 (STP2PT, ~LPTOVF, S5);  // and2b1
  and U17 (STP1PT, ~LPTOVF, S2);  // and2b1
  and U16 (STDISP0, PSEL0, CALCPTS);
  and U4 (GETCODE, INITIALSHIFT, S0);
  cb2ce U6 (.C(SYSCLK), .CE(CLRSHFTREG), .CLR(CLRRDREGS), .TC(INITIALSHIFT));  // open: CEO, Q0, Q1
  buf CLEAR_BUF (CLEAR, RESET);
  fdc U72 (.C(RDCLK), .CLR(1'b0), .D(P2PLAY), .Q(XLXN_10484));
  fdc U74 (.C(SYSCLK), .CLR(1'b0), .D(XLXN_10482), .Q(XLXN_10495));
  fdc U73 (.C(P2CLK), .CLR(1'b0), .D(XLXN_10484), .Q(XLXN_10482));
  and U75 (P2PLAYSYNCH, ~XLXN_10495, XLXN_10482, XLXN_10484);  // and3b1
  cb16ce U66 (.C(CLOCK), .CE(1'b1), .CLR(1'b0), .Q(QA));  // open: CEO, TC
  cb16ce U67 (.C(QA[15]), .CE(1'b1), .CLR(1'b0), .Q(Q));  // open: CEO, TC
  bufg RDCLK_BUFG (.I(Q[2]), .O(RDCLK));
  bufg SYSCLK_BUFG (.I(Q[7]), .O(SYSCLK));
  bufg P2CLK_BUFG (.I(Q[4]), .O(P2CLK));
  fdc U76 (.C(RDCLK), .CLR(1'b0), .D(P1PLAY), .Q(XLXN_10962));
  fdc U77 (.C(P2CLK), .CLR(1'b0), .D(XLXN_10962), .Q(XLXN_10958));
  fdc U78 (.C(SYSCLK), .CLR(1'b0), .D(XLXN_10958), .Q(XLXN_10960));
  and U79 (P1PLAYSYNCH, ~XLXN_10960, XLXN_10958, XLXN_10962);  // and3b1
  and U22 (CLRRDREGS, ~XLXN_11102, XLXN_10478, XLXN_10471);  // and3b1
  and U23 (ADD, ~LPTOVF, XLXN_9551);  // and2b1
  fdc U19 (.C(P2CLK), .CLR(S1), .D(CLEAR), .Q(XLXN_10471));
  fdc U21 (.C(P2CLK), .CLR(S1), .D(XLXN_10478), .Q(XLXN_11102));
  fdc U20 (.C(P2CLK), .CLR(S1), .D(XLXN_10471), .Q(XLXN_10478));
  fdce U71 (.C(SYSCLK), .CE(XLXN_74), .CLR(CLEAR), .D(PTOVF), .Q(LPTOVF));
  fd4ce U69 (
    .C(SYSCLK), .CE(CALCPTS), .CLR(CLFF), .D0(PSEL0), .D1(PSEL1), .D2(PSEL2), .D3(PSEL3), .Q0(LPSEL0),
    .Q1(LPSEL1), .Q2(LPSEL2), .Q3(LPSEL3));
  fdce U68 (.C(SYSCLK), .CE(CALCPTS), .CLR(CLFF), .D(PDPRD), .Q(LPDPRD));
  or U70 (XLXN_74, STP2PT, STP1PT);
  add4 U150 (
    .A0(RD0), .A1(RD1), .A2(RD2), .A3(RD3), .B0(DISP12), .B1(DISP13), .B2(DISP14), .B3(DISP15), .CI(1'b0),
    .CO(PD3PRD), .S0(NPDISP12), .S1(NPDISP13), .S2(NPDISP14), .S3(NPDISP15));  // open: OFL
  add4 U151 (
    .A0(RD0), .A1(RD1), .A2(RD2), .A3(RD3), .B0(DISP8), .B1(DISP9), .B2(DISP10), .B3(DISP11), .CI(1'b0),
    .CO(PD2PRD), .S0(NPDISP8), .S1(NPDISP9), .S2(NPDISP10), .S3(NPDISP11));  // open: OFL
  add4 U149 (
    .A0(RD0), .A1(RD1), .A2(RD2), .A3(RD3), .B0(DISP0), .B1(DISP1), .B2(DISP2), .B3(DISP3), .CI(1'b0),
    .CO(PD0PRD), .S0(NPDISP0), .S1(NPDISP1), .S2(NPDISP2), .S3(NPDISP3));  // open: OFL
  add4 U148 (
    .A0(RD0), .A1(RD1), .A2(RD2), .A3(RD3), .B0(DISP4), .B1(DISP5), .B2(DISP6), .B3(DISP7), .CI(1'b0),
    .CO(PD1PRD), .S0(NPDISP4), .S1(NPDISP5), .S2(NPDISP6), .S3(NPDISP7));  // open: OFL
  and U136 (XLXN_11265, CALCPTS, CDEQBRWD0, PSEL0);
  nor U138 (ENCODERWDMUX, XLXN_11266, XLXN_11265);
  and U139 (XLXN_11270, CDEQPD1, XLXN_11265);
  or U141 (CODERWDMUXSEL1, XLXN_11271, XLXN_11270);
  and U140 (XLXN_11271, XLXN_11266, CDEQPD0);
  and U137 (XLXN_11266, CALCPTS, CDEQBRWD1, PSEL1);
  nor U129 (XLXN_11294, R2D0, RDC3, R1D3);
  fd4ce U131 (
    .C(SYSCLK), .CE(GETCODE), .CLR(CLRRDREGS), .D0(XLXN_11292), .D1(R1D3), .D2(RDC3), .D3(R2D0), .Q0(CODE4),
    .Q1(CODE5), .Q2(CODE6), .Q3(CODE7));
  or U130 (XLXN_11292, XLXN_11294, R2D1);
  or U127 (XLXN_11310, XLXN_11295, R1D1);
  nor U126 (XLXN_11295, R1D0, RDC1, R2D2);
  fd4ce U128 (
    .C(SYSCLK), .CE(GETCODE), .CLR(CLRRDREGS), .D0(XLXN_11310), .D1(R2D2), .D2(RDC1), .D3(R1D0), .Q0(CODE0),
    .Q1(CODE1), .Q2(CODE2), .Q3(CODE3));
  comp4 U134 (
    .A0(CODE0), .A1(CODE1), .A2(CODE2), .A3(CODE3), .B0(DISP0), .B1(DISP1), .B2(DISP2), .B3(DISP3),
    .EQ(CDEQPD0));
  comp4 U132 (
    .A0(CODE0), .A1(CODE1), .A2(CODE2), .A3(CODE3), .B0(BRWD0), .B1(BRWD1), .B2(BRWD2), .B3(BRWD3),
    .EQ(CDEQBRWD0));
  comp4 U133 (
    .A0(CODE4), .A1(CODE5), .A2(CODE6), .A3(CODE7), .B0(BRWD0), .B1(BRWD1), .B2(BRWD2), .B3(BRWD3),
    .EQ(CDEQBRWD1));
  comp4 U135 (
    .A0(CODE4), .A1(CODE5), .A2(CODE6), .A3(CODE7), .B0(DISP4), .B1(DISP5), .B2(DISP6), .B3(DISP7),
    .EQ(CDEQPD1));
  and U144 (CODERWD[2], XLXN_11347, CODE2);
  and U145 (CODERWD[1], XLXN_11347, CODE1);
  and U143 (CODERWD[7], XLXN_11347, CODE7);
  and U146 (CODERWD[0], XLXN_11347, CODE0);
  and U147 (XLXN_11347, ~ENCODERWDMUX, CODERWDMUXSEL1);  // and2b1
  or U180 (PTOVF, RWDCOT, XLXN_1802);
  comp4 U162 (
    .A0(BRWD0), .A1(BRWD1), .A2(BRWD2), .A3(BRWD3), .B0(DISP8), .B1(DISP9), .B2(DISP10), .B3(DISP11), .EQ(EQ2));
  comp4 U161 (
    .A0(BRWD0), .A1(BRWD1), .A2(BRWD2), .A3(BRWD3), .B0(DISP12), .B1(DISP13), .B2(DISP14), .B3(DISP15),
    .EQ(EQ3));
  comp4 U159 (.A0(BRWD0), .A1(BRWD1), .A2(BRWD2), .A3(BRWD3), .B0(DISP4), .B1(DISP5), .B2(DISP6), .B3(DISP7), .EQ(EQ1));
  comp4 U160 (.A0(BRWD0), .A1(BRWD1), .A2(BRWD2), .A3(BRWD3), .B0(DISP0), .B1(DISP1), .B2(DISP2), .B3(DISP3), .EQ(EQ0));
  not U175 (XLXN_1764, NSD1);
  and U177 (RWD[0], ~NSD1, ~NSD0, BRWD0);  // and3b2
  m2_1e U176 (.D0(BRWD1), .D1(BRWD0), .E(XLXN_1764), .S0(NSD0), .O(RWD[1]));
  X74_153 U174 (
    .A0(BRWD2), .A1(BRWD1), .A2(BRWD0), .A3(1'b0), .B0(BRWD3), .B1(BRWD2), .B2(BRWD1), .B3(BRWD0), .G0(1'b0),
    .G1(1'b0), .S0(NSD0), .S1(NSD1), .Y1(RWD[2]), .Y2(RWD[3]));
  and U172 (RWD[6], NSD1, NSD0, BRWD3);
  X74_153 U173 (
    .A0(1'b0), .A1(BRWD3), .A2(BRWD2), .A3(BRWD1), .B0(1'b0), .B1(1'b0), .B2(BRWD3), .B3(BRWD2), .G0(1'b0),
    .G1(1'b0), .S0(NSD0), .S1(NSD1), .Y1(RWD[4]), .Y2(RWD[5]));
  X74_153 U170 (
    .A0(RDP0EQ0), .A1(RDP1EQ0), .A2(RDP2EQ0), .A3(RDP3EQ0), .B0(RDP0EQ1), .B1(RDP1EQ1), .B2(RDP2EQ1),
    .B3(RDP3EQ1), .G0(1'b0), .G1(1'b0), .S0(ENCPSEL0), .S1(ENCPSEL1), .Y1(UNENCNSD0), .Y2(UNENCNSD1));
  m4_1e U169 (
    .D0(RDP0EQ2), .D1(RDP1EQ2), .D2(RDP2EQ2), .D3(RDP3EQ2), .E(1'b1), .S0(ENCPSEL0), .S1(ENCPSEL1),
    .O(UNENCNSD2));
  add4 U171 (
    .A0(UNENCNSD1), .A1(1'b0), .A2(1'b0), .A3(1'b0), .B0(UNENCNSD2), .B1(1'b0), .B2(1'b0), .B3(1'b0),
    .CI(UNENCNSD0), .S0(NSD0), .S1(NSD1));  // open: CO, OFL, S2, S3
  and U168 (RDP0EQ0, RDP0EQ1, EQ3);
  buf RDP0EQ2_BUF (RDP0EQ2, EQ1);
  and U167 (RDP0EQ1, RDP0EQ2, EQ2);
  buf RDP1EQ2_B (RDP1EQ2, EQ0);
  and U166 (RDP1EQ0, RDP1EQ1, EQ3);
  buf RDP1EQ1_BUF (RDP1EQ1, EQ2);
  buf RDP2EQ1_B (RDP2EQ1, EQ1);
  and U165 (RDP2EQ0, RDP2EQ1, EQ0);
  buf RDP2EQ2_BUF (RDP2EQ2, EQ3);
  and U164 (RDP3EQ0, RDP3EQ1, EQ0);
  buf RDP3EQ2_BUF (RDP3EQ2, EQ2);
  and U163 (RDP3EQ1, RDP3EQ2, EQ1);
  add8 U182 (.A({1'b0, RWD}), .B(CODERWD), .CI(1'b0), .CO(RWDCOT), .S(TOTRWD));  // open: OFL
  add8 U181 (.A(PT), .B(TOTRWD), .CI(1'b0), .CO(XLXN_1802), .S(NPT));  // open: OFL
  title #(.NameFieldText("Haldun Hadimioglu - Vivek S. Pujeri"), .TitleFieldText("Ppm Control Unit")) XLXI_1261 ();
  title #(.TitleFieldText("Ppm Input/output Block"), .NameFieldText("Haldun Hadimioglu - Vivek S. Pujeri")) XLXI_1267 ();
  title #(.TitleFieldText("Ppm Play Check Block"), .NameFieldText("Haldun Hadimioglu - Vivek S. Pujeri")) XLXI_1264 ();
  title #(.TitleFieldText("Ppm Points Calculation Block"), .NameFieldText("Haldun Hadimioglu - Vivek S. Pujeri")) XLXI_1265 ();
  X74_153 U82 (
    .A0(DISP6), .A1(P1PT[6]), .A2(R2D2), .A3(P2CODE6), .B0(DISP7), .B1(P1PT[7]), .B2(R2D3), .B3(P2CODE7),
    .G0(1'b0), .G1(1'b0), .S0(DISPSEL0), .S1(DISPSEL1), .Y1(DDISP6), .Y2(DDISP7));
  X74_157 U80 (
    .A0(DISP12), .A1(DISP13), .A2(DISP14), .A3(DISP15), .B0(P2PT[4]), .B1(P2PT[5]), .B2(P2PT[6]),
    .B3(P2PT[7]), .G(1'b0), .S(DISPSEL0), .Y0(DDISP12), .Y3(DDISP15), .Y1(DDISP13), .Y2(DDISP14));
  X74_157 U81 (
    .A0(DISP8), .A1(DISP9), .A2(DISP10), .A3(DISP11), .B0(P2PT[0]), .B1(P2PT[1]), .B2(P2PT[2]), .B3(P2PT[3]),
    .G(1'b0), .S(DISPSEL0), .Y0(DDISP8), .Y3(DDISP11), .Y1(DDISP9), .Y2(DDISP10));
  X74_157 U142 (
    .A0(BRWD0), .A1(BRWD1), .A2(BRWD2), .A3(BRWD3), .B0(CODE3), .B1(CODE4), .B2(CODE5), .B3(CODE6),
    .G(ENCODERWDMUX), .S(CODERWDMUXSEL1), .Y0(CODERWD[3]), .Y3(CODERWD[6]), .Y1(CODERWD[4]), .Y2(CODERWD[5]));
  X74_157 U152 (
    .A0(P1SEL[0]), .A1(P1SEL[1]), .A2(P1SEL[2]), .A3(P1SEL[3]), .B0(P2SEL0), .B1(P2SEL1), .B2(P2SEL2),
    .B3(P2SEL3), .G(1'b0), .S(SELPLYR), .Y0(PSEL0), .Y3(PSEL3), .Y1(PSEL1), .Y2(PSEL2));
  X74_157 U158 (
    .A0(RD0), .A1(RD1), .A2(RD2), .A3(RD3), .B0(NPSELDISP0), .B1(NPSELDISP1), .B2(NPSELDISP2),
    .B3(NPSELDISP3), .G(1'b0), .S(ADD), .Y0(BRWD0), .Y3(BRWD3), .Y1(BRWD1), .Y2(BRWD2));
  X74_157 U178 (
    .A0(P1PT[4]), .A1(P1PT[5]), .A2(P1PT[6]), .A3(P1PT[7]), .B0(P2PT[4]), .B1(P2PT[5]), .B2(P2PT[6]),
    .B3(P2PT[7]), .G(1'b0), .S(SELPLYR), .Y0(PT[4]), .Y3(PT[7]), .Y1(PT[5]), .Y2(PT[6]));
  X74_157 U179 (
    .A0(P1PT[0]), .A1(P1PT[1]), .A2(P1PT[2]), .A3(P1PT[3]), .B0(P2PT[0]), .B1(P2PT[1]), .B2(P2PT[2]),
    .B3(P2PT[3]), .G(1'b0), .S(SELPLYR), .Y0(PT[0]), .Y3(PT[3]), .Y1(PT[1]), .Y2(PT[2]));
  title #(.TitleFieldText("Ppm Human Play Block"), .NameFieldText("Haldun Hadimioglu - Vivek S. Pujeri")) XLXI_1286 ();
  X74_157 XLXI_1287 (
    .A0(R0D0), .A1(R0D1), .A2(R0D2), .A3(R0D3), .B0(P1ADD), .B1(TRD1), .B2(TRD2), .B3(TRD3), .G(1'b0),
    .S(XLXN_1346), .Y0(RD0), .Y3(RD3), .Y1(RD1), .Y2(RD2));
  title #(.TitleFieldText("Ppm Machine Play Block"), .NameFieldText("Haldun Hadimioglu - Vivek S. Pujeri")) XLXI_1288 ();
  title #(.TitleFieldText("FPGA Input/output Block"), .NameFieldText("Haldun Hadimioglu - Vivek S. Pujeri")) XLXI_1289 ();
  ibuf XLXI_1290 (.I(P1SEL3_NP2B), .O(P1SEL[3]));
  ibuf XLXI_1291 (.I(P1SEL2_NP2B), .O(P1SEL[2]));
  ibuf XLXI_1292 (.I(P1SEL1_NP2B), .O(P1SEL[1]));
  ibuf XLXI_1293 (.I(P1SEL0_NP2B), .O(P1SEL[0]));
  ibuf XLXI_1294 (.I(TRD3_NP2B), .O(TRD3));
  ibuf XLXI_1295 (.I(TRD2_NP2B), .O(TRD2));
  ibuf XLXI_1296 (.I(TRD1_NP2B), .O(TRD1));
  ibuf XLXI_1297 (.I(P1ADD_NP2B), .O(P1ADD));
  ibuf XLXI_1298 (.I(P1PLAY_NP2B), .O(P1PLAY));
  ibuf XLXI_1299 (.I(P2PLAY_NP2B), .O(P2PLAY));
  ibuf XLXI_1300 (.I(RESET_NP2B), .O(RESET));
  ibuf XLXI_1301 (.I(SHPTS_NP2B), .O(SHPTS));
  ibuf XLXI_1302 (.I(CLOCK_NP2B), .O(CLOCK_B2B));
  obuf XLXI_1303 (.I(RD3), .O(RD3_NB2P));
  obuf XLXI_1304 (.I(RD2), .O(RD2_NB2P));
  obuf XLXI_1305 (.I(RD1), .O(RD1_NB2P));
  obuf XLXI_1306 (.I(RD0), .O(RD0_NB2P));
  obuf XLXI_1307 (.I(ADD), .O(ADD_NB2P));
  obuf XLXI_1308 (.I(STR2), .O(STR2_NB2P));
  obuf XLXI_1309 (.I(STR1), .O(STR1_NB2P));
  obuf XLXI_1310 (.I(STR0), .O(STR0_NB2P));
  obuf XLXI_1315 (.I(SBUS[0]), .O(CG_NB2P));
  obuf XLXI_1316 (.I(SBUS[1]), .O(CF_NB2P));
  obuf XLXI_1317 (.I(SBUS[2]), .O(CE_NB2P));
  obuf XLXI_1318 (.I(SBUS[3]), .O(CD_NB2P));
  obuf XLXI_1319 (.I(SBUS[4]), .O(CC_NB2P));
  obuf XLXI_1320 (.I(SBUS[5]), .O(CB_NB2P));
  obuf XLXI_1321 (.I(SBUS[6]), .O(CA_NB2P));
  obuf XLXI_1512 (.I(XLXN_12043), .O(A7_NB2P));
  obuf XLXI_1511 (.I(XLXN_12042), .O(A6_NB2P));
  obuf XLXI_1510 (.I(XLXN_12041), .O(A5_NB2P));
  obuf XLXI_1509 (.I(XLXN_12049), .O(A4_NB2P));
  obuf XLXI_1314 (.I(DISPEN[3]), .O(A3_NB2P));
  obuf XLXI_1311 (.I(DISPEN[2]), .O(A2_NB2P));
  obuf XLXI_1312 (.I(DISPEN[1]), .O(A1_NB2P));
  obuf XLXI_1313 (.I(DISPEN[0]), .O(A0_NB2P));
  or U88 (XLXN_203, ~BPDS, Q[8]);  // or2b1
  and U89 (INT_NET0, XLXN_203, XLXN_202);
  or U92 (XLXN_181, ~LPSEL0, INT_NET0);  // or2b1
  or U94 (XLXN_195, ~LPSEL1, INT_NET0);  // or2b1
  or U96 (XLXN_194, ~LPSEL2, INT_NET0);  // or2b1
  or U98 (XLXN_193, ~LPSEL3, INT_NET0);  // or2b1
  nand U95 (DISPEN[1], DCDEN1, XLXN_195);
  nand U97 (DISPEN[2], DCDEN2, XLXN_194);
  nand U99 (DISPEN[3], DCDEN3, XLXN_193);
  nand U93 (DISPEN[0], DCDEN0, XLXN_181);
  or U87 (XLXN_202, ~BPDF, Q[6]);  // or2b1
  cb4ce XLXI_1513 (.C(Q[0]), .CE(1'b1), .CLR(1'b0), .Q0(MC0), .Q1(MC1), .Q2(MC2));  // open: CEO, Q3, TC
  or U90 (XLXN_210, ~LPTOVF, Q[8]);  // or2b1
  m8_1e XLXI_1542 (
    .D0(DDISP1), .D1(DDISP5), .D2(DDISP9), .D3(DDISP13), .D4(P1PT[1]), .D5(P1PT[5]), .D6(P2PT[1]),
    .D7(P2PT[5]), .E(1'b1), .S0(MC0), .S1(MC1), .S2(MC2), .O(KSBUS[1]));
  m8_1e XLXI_1543 (
    .D0(DDISP3), .D1(DDISP7), .D2(DDISP11), .D3(DDISP15), .D4(P1PT[3]), .D5(P1PT[7]), .D6(P2PT[3]),
    .D7(P2PT[7]), .E(1'b1), .S0(MC0), .S1(MC1), .S2(MC2), .O(KSBUS[3]));
  m8_1e XLXI_1544 (
    .D0(DDISP0), .D1(DDISP4), .D2(DDISP8), .D3(DDISP12), .D4(P1PT[0]), .D5(P1PT[4]), .D6(P2PT[0]),
    .D7(P2PT[4]), .E(1'b1), .S0(MC0), .S1(MC1), .S2(MC2), .O(KSBUS[0]));
  m8_1e XLXI_1545 (
    .D0(DDISP2), .D1(DDISP6), .D2(DDISP10), .D3(DDISP14), .D4(P1PT[2]), .D5(P1PT[6]), .D6(P2PT[2]),
    .D7(P2PT[6]), .E(1'b1), .S0(MC0), .S1(MC1), .S2(MC2), .O(KSBUS[2]));
  bufg CLOCK_BUFG (.I(CLOCK_B2B), .O(CLOCK));
  d3_8e XLXI_1564 (
    .A0(MC0), .A1(MC1), .A2(MC2), .E(XLXN_210), .D0(DCDEN0), .D1(DCDEN1), .D2(DCDEN2), .D3(DCDEN3),
    .D4(DCDEN4), .D5(DCDEN5), .D6(DCDEN6), .D7(DCDEN7));
  not XLXI_1576 (XLXN_12042, DCDEN6);
  not XLXI_1577 (XLXN_12043, DCDEN7);
  not XLXI_1575 (XLXN_12041, DCDEN5);
  not XLXI_1566 (XLXN_12049, DCDEN4);
  microblaze_mcs mcs_0 (
    .clk(CLOCK), .reset(1'b0), .uart_tx(UART_TX), .uart_rx(UART_RX), .gpi1(gpi1), .gpo1(gpo1));  // open: fit1_toggle, fit1_interrupt, gpi2, gpi3, gpi4, gpo2, gpo3, gpo4, intc_irq
  buf XLXI_1345 (gpi1[21], S0);
  buf XLXI_1344 (gpi1[22], S1);
  buf XLXI_1343 (gpi1[23], S2);
  buf XLXI_1342 (gpi1[24], S3);
  buf XLXI_1341 (gpi1[25], S4);
  buf XLXI_1340 (gpi1[26], S5);
  buf XLXI_1339 (gpi1[27], S6);
  buf XLXI_1330 (gpi1[20], P2STURN);
  buf XLXI_1329 (gpi1[16], RD0);
  buf XLXI_1328 (gpi1[17], RD1);
  buf XLXI_1327 (gpi1[18], RD2);
  buf XLXI_1722 (gpi1[19], RD3);
  buf XLXI_1723 (gpi1[14], DISP14);
  buf XLXI_1724 (gpi1[13], DISP13);
  buf XLXI_1725 (gpi1[15], DISP15);
  buf XLXI_1726 (gpi1[12], DISP12);
  buf XLXI_1727 (gpi1[10], DISP10);
  buf XLXI_1728 (gpi1[9], DISP9);
  buf XLXI_1729 (gpi1[11], DISP11);
  buf XLXI_1730 (gpi1[8], DISP8);
  buf XLXI_1731 (gpi1[6], DISP6);
  buf XLXI_1732 (gpi1[5], DISP5);
  buf XLXI_1733 (gpi1[7], DISP7);
  buf XLXI_1734 (gpi1[4], DISP4);
  buf XLXI_1735 (gpi1[2], DISP2);
  buf XLXI_1736 (gpi1[1], DISP1);
  buf XLXI_1737 (gpi1[3], DISP3);
  buf XLXI_1738 (gpi1[0], DISP0);
  buf XLXI_1331 (P2ADD, gpo1[0]);
  buf XLXI_1332 (P2PLAYED, gpo1[1]);
  buf XLXI_1335 (P2SEL2, gpo1[4]);
  buf XLXI_1336 (P2SEL1, gpo1[3]);
  buf XLXI_1337 (P2SEL0, gpo1[2]);
  buf XLXI_1338 (P2SKIP, gpo1[6]);
  buf XLXI_1333 (P2SEL3, gpo1[5]);

  // Notes on the sheet:
  //   Control Signal Generation
  //   Next State Generation
  //   Latching Subsubblock
  //   Clock Signal Generation Subsubblock
  //   Timing Subblock
  //   Debouncing Subsubblock
  //   7-Segment Digit Content Selection Subsubblock
  //   Display Subblock
  //   7-Segment Digit Control Subsubblock
  //   7-Segment Digit Selection Subsubblock
  //   Hex-to-7-Segment Converter Subsubblock
  //   Player's Points Storage Subsubblock
  //   Random Digit Generation Subsubblock
  //   Position Display Storage Subsubblock
  //   Points Display, Points Storage and Random Number Generation Subblock
  //   Display Add and Compare Subblock
  //   Adding RD to the Displays Subsubblock
  //   Code Storage and Code Reward Calculation Subsubblock
  //   Player 1-2 Multiplexing Subsubblock
  //   Select Digit to Store Subsubblock
  //   Select Compare Result Subsubblock
  //   Play Digit Determination Subblock
  //   Adjacency Subblock
  //   Encoded Adjacency Subsubblock
  //   Unencoded Adjacency Subsubblock
  //   Adjacent Similar Digit Subsubblock
  //   Equality Check Subsubblock
  //   Regular Reward Calculation Subblock
  //   Points Subblock
  //   Select Player Points Subblock
  //   POINTS ADDITION SUB-BLOCK
  //   I/O BUFFER SUB-BLOCK
  //   I/O PADs
endmodule
